# EAGLE board BSides 2015 RevA (EAGLE 7.2.0), part 1 of 5
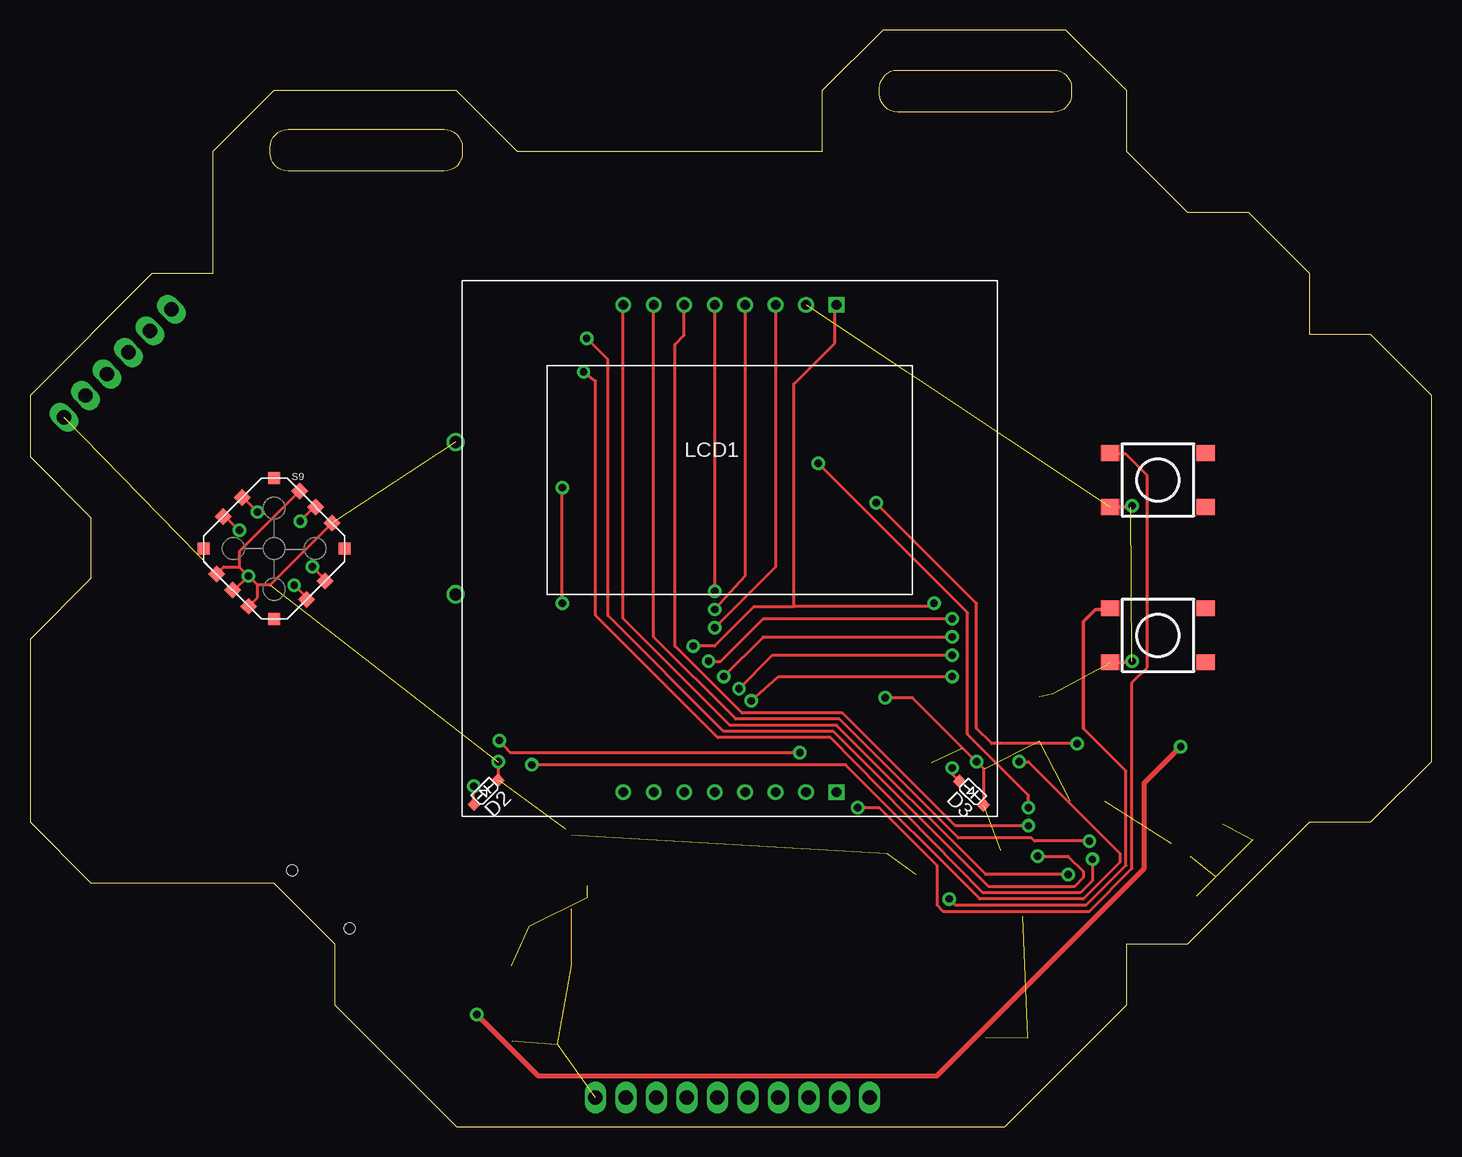
[diagram p1: board, top side]
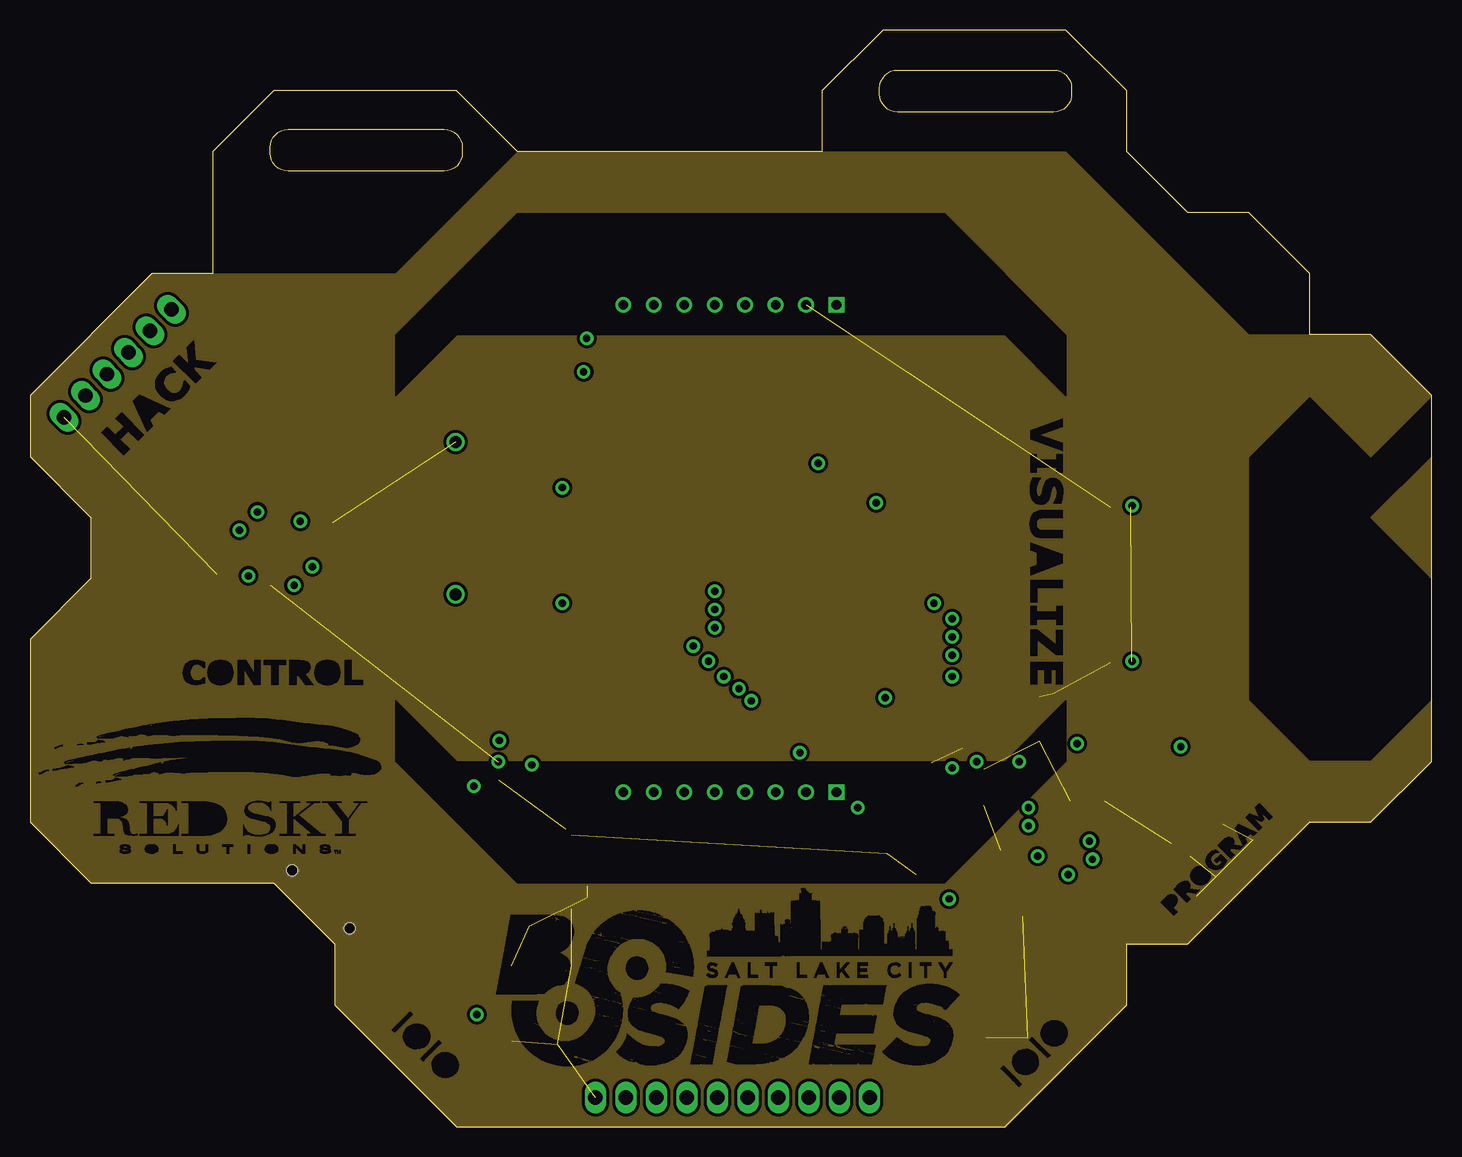
[diagram p2: board, inner layer Route2]
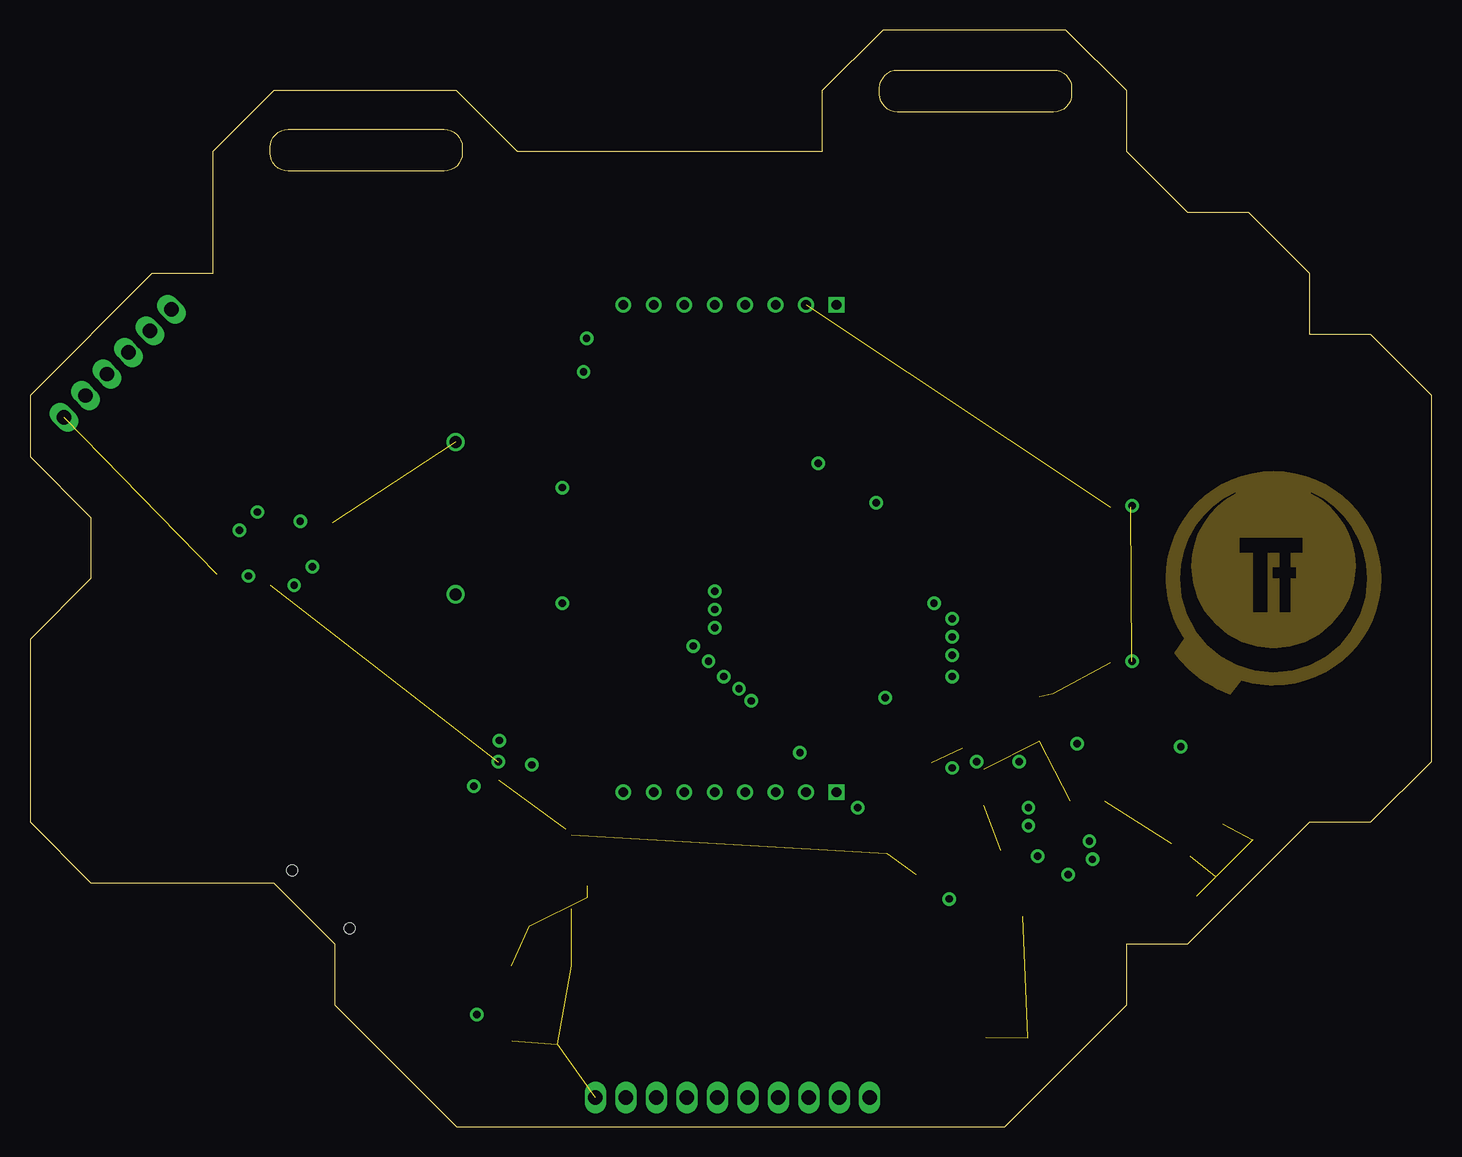
[diagram p3: board, inner layer Route3]
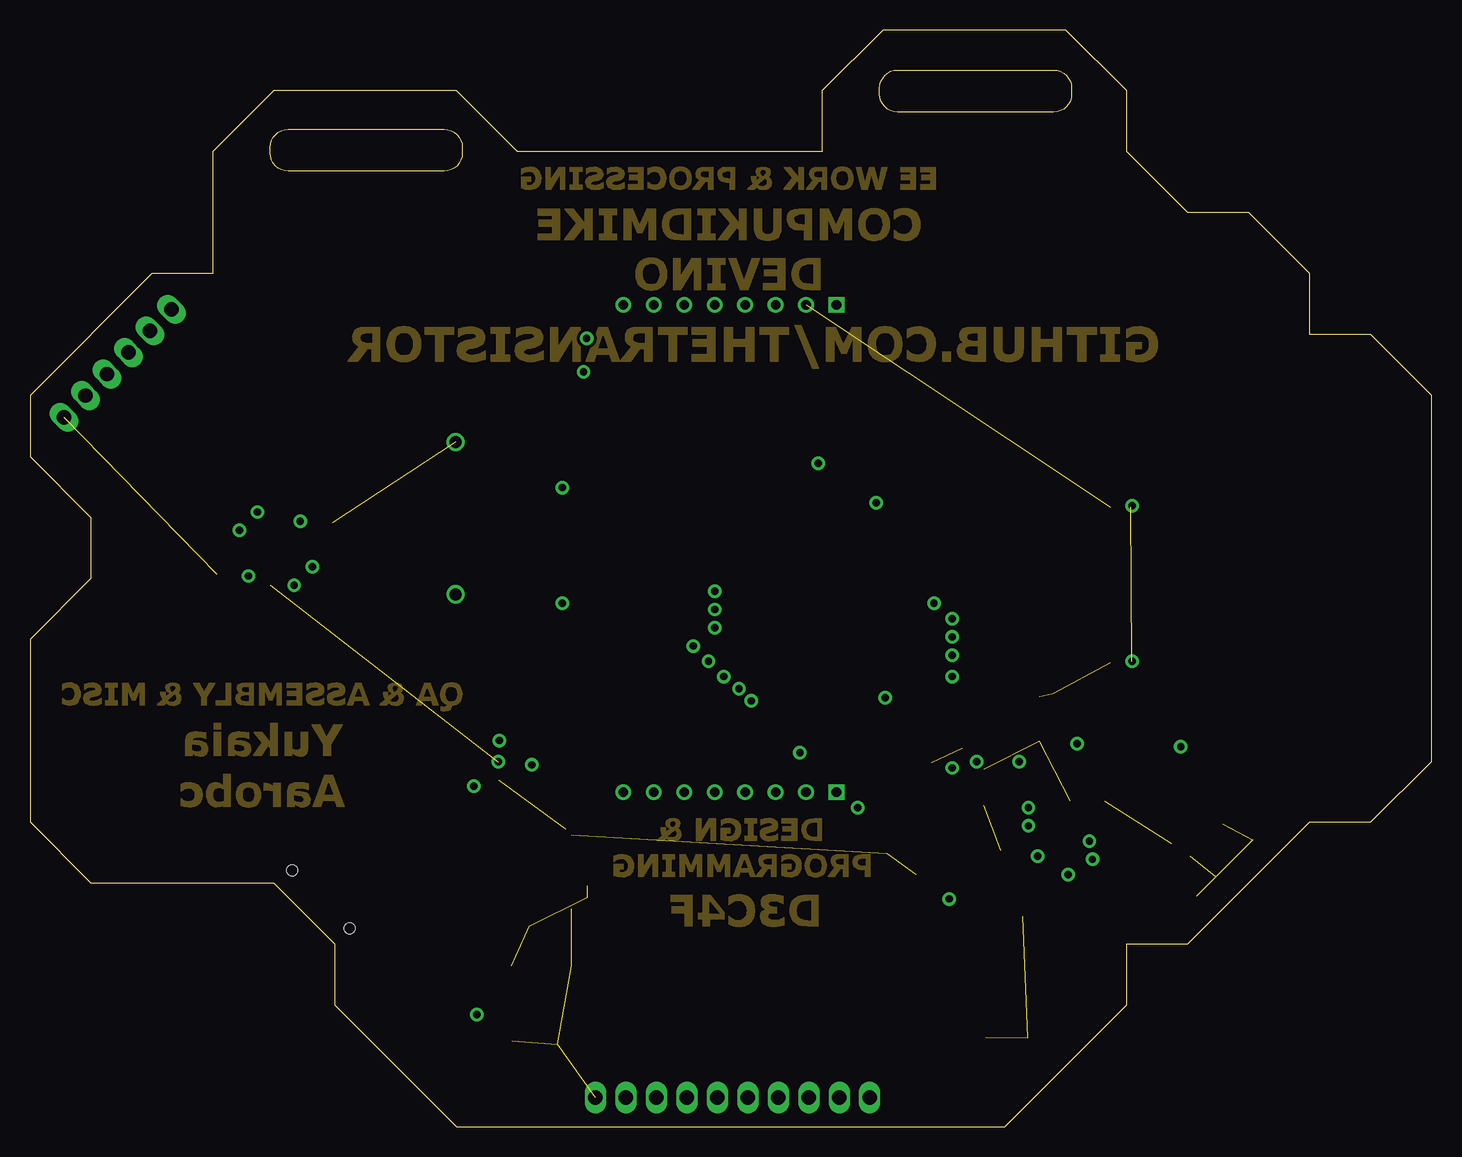
[diagram p4: board, inner layer Route4]
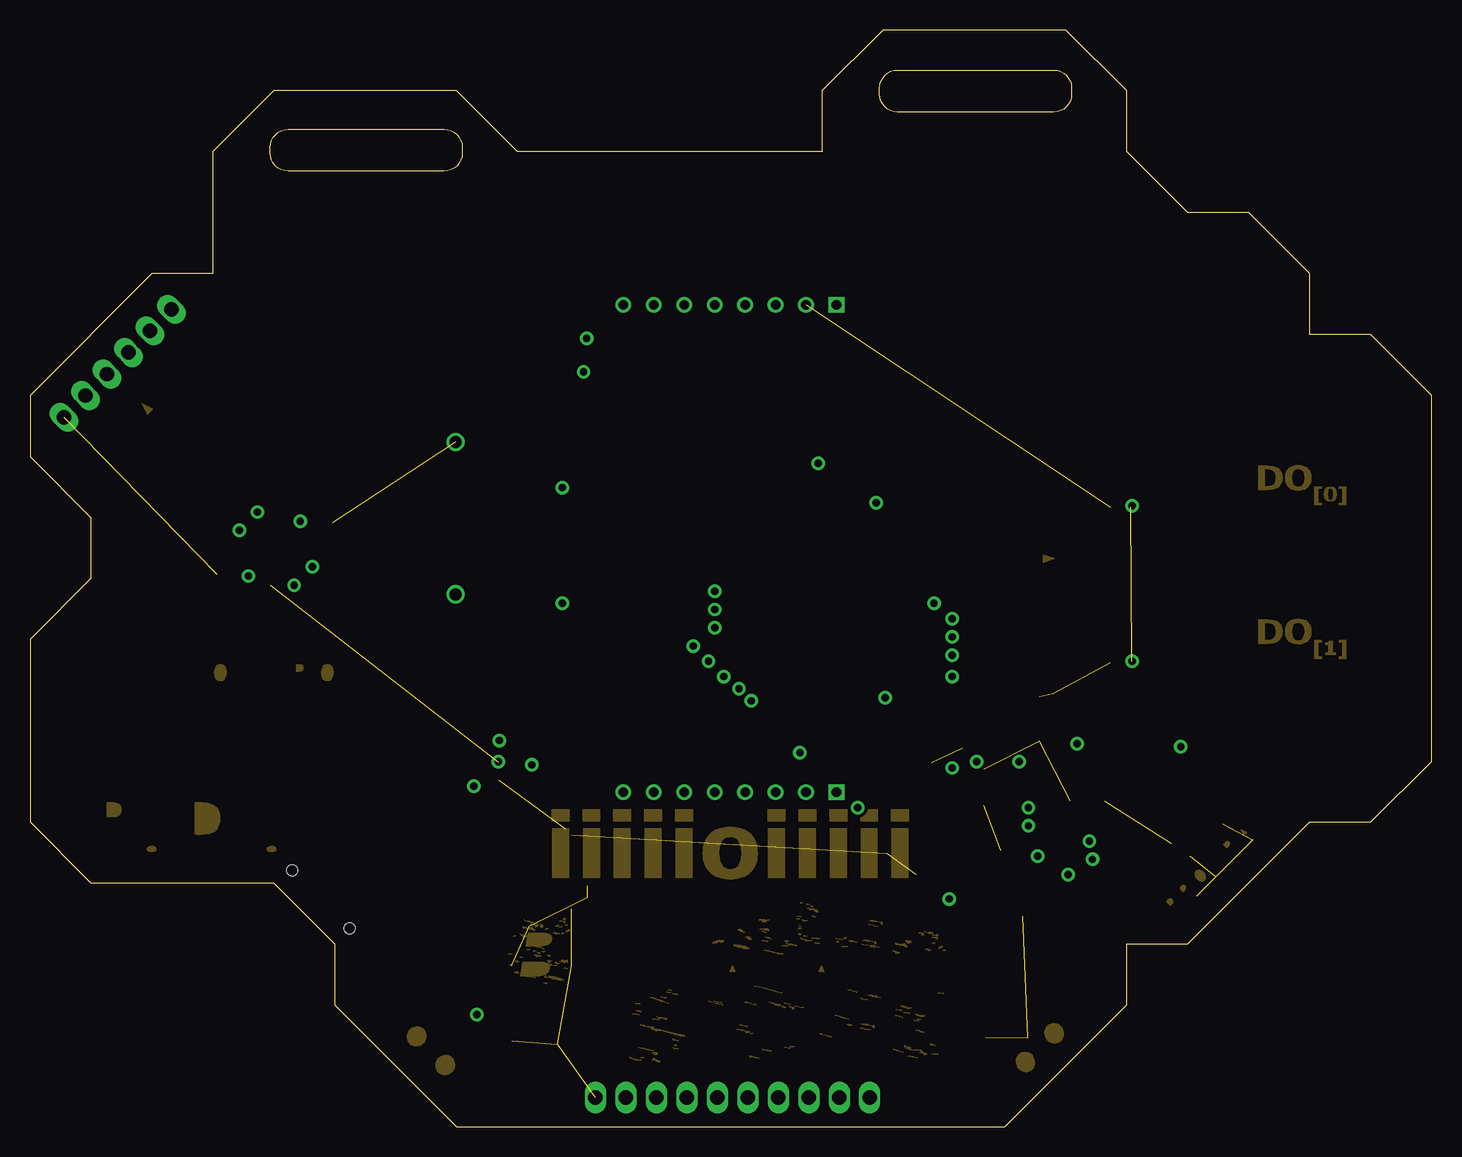
[diagram p5: board, inner layer Route15]
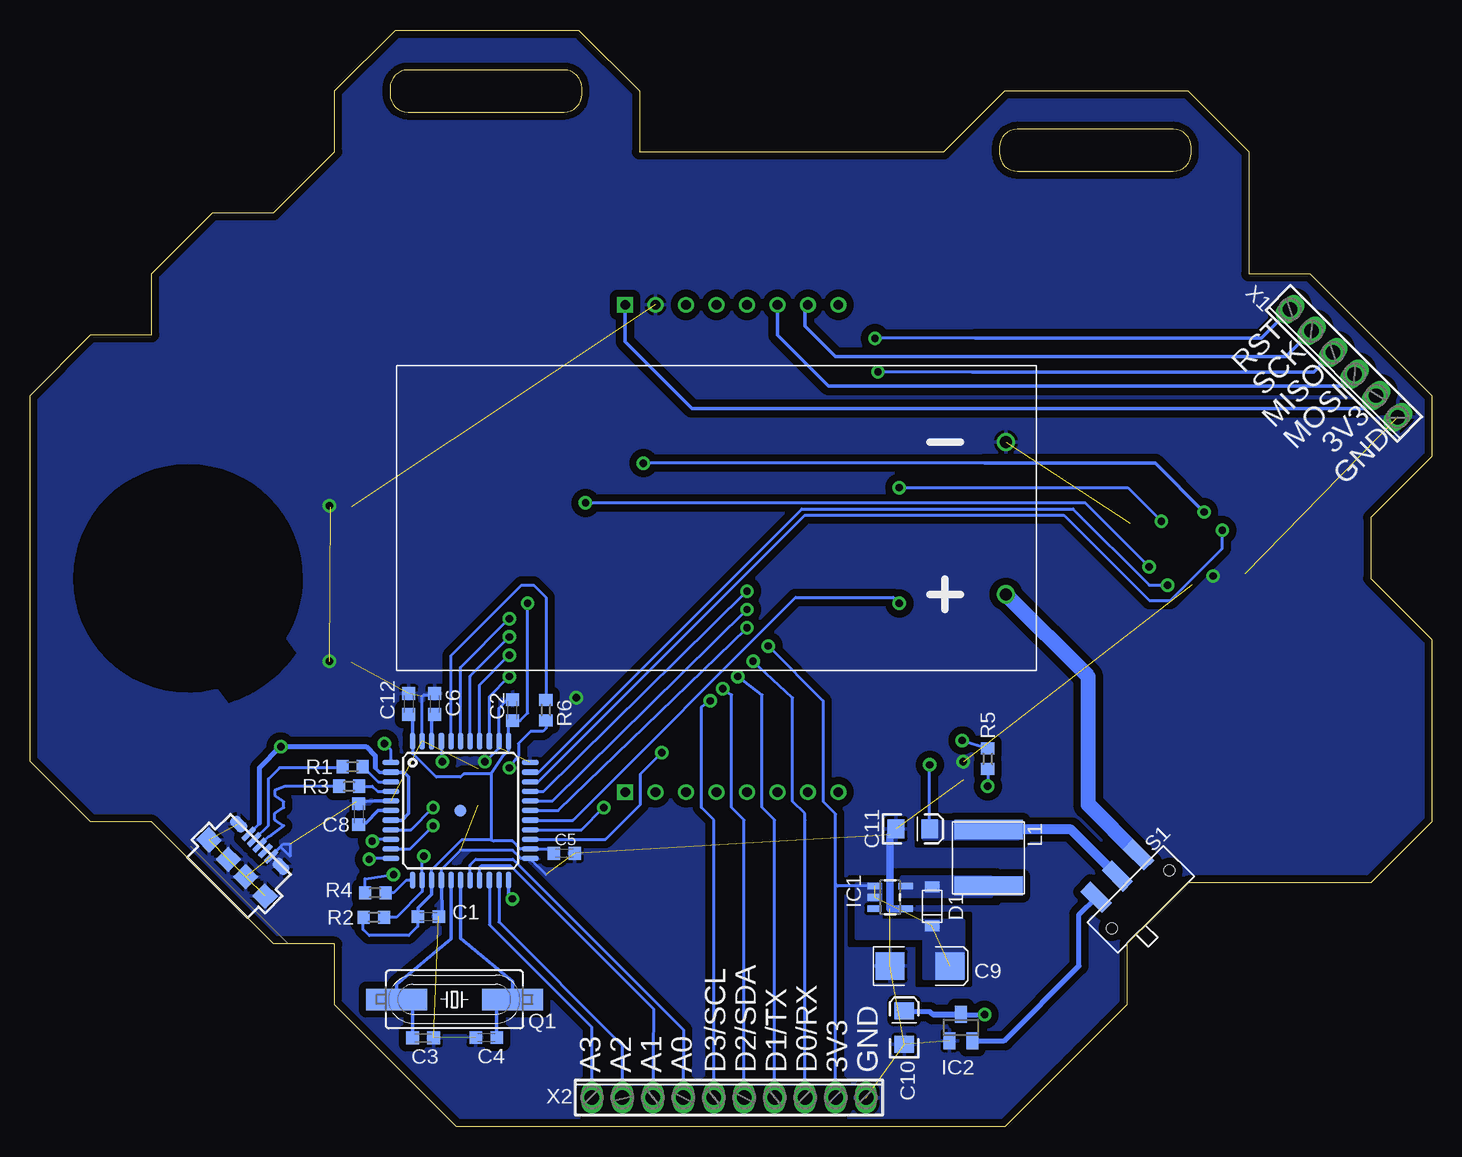
[diagram p6: board, bottom side, seen from below]

Size 116.84 x 91.44 mm. Coordinates in mm from the lower left corner, seen from the top.
Outline: 108 segments
Copper layers (1+2*15+16): Top 0.035mm / dielectric 1.5mm / Route2 0.035mm / dielectric 0.15mm / Route15 0.035mm / dielectric 0.2mm / Bottom 0.035mm
Design rules "default *": minimum track width 10mil, minimum drill 22mil, track to track 10mil, track to pad 10mil, pad to pad 8mil, via to via 12mil, smd to smd 8mil, copper to edge 1mil, drill to drill 12mil, minimum pad ring 10mil, minimum via ring 10mil, stop-mask expansion 2mil, vias tented up to drill 23mil, thermal gap 10mil
Net classes: 0 default: width 0.254 mm, drill 0.61 mm, clearance 0.254 mm; 1 power: width 0.254 mm, drill 0.61 mm, clearance 0.254 mm; 2 gnd: width 0.254 mm, drill 0.61 mm, clearance 0.254 mm; 3 usbvcc: width 0.254 mm, drill 0.61 mm, clearance 0.254 mm; 4 aref: width 0.254 mm, drill 0.61 mm, clearance 0.254 mm
bRestrict: area 78.4,8.3 to 84.5,12.9
vRestrict: area 42.5,38.6 to 43,38.8; area 35.7,35.1 to 36.4,35.6; area 44.4,35.1 to 45.1,35.6; area 41.2,35.1 to 41.7,35.6; area 47.8,10.2 to 48.4,10.7; area 50.3,10.1 to 50.8,11

## Footprints (pad centres in the part's own frame; a part is rotated, then mirrored left to right if it is on the bottom)
2AAA = drill 1: + 24.13,-6.35; - 24.13,6.35
C0603K = smd 1.05 x 1.08: 1 -0.875,0; 2 0.875,0
6032 = smd 2.4 x 2.3: P$1 2.5,0; P$2 -2.5,0
EIA3216 = smd 1.4 x 1.6: A 1.4,0; C -1.4,0
SOD-123 = smd 0.91 x 1.22: P$1 -1.63,0; P$2 1.63,0
LG-Y876 = smd 0.8 x 0.7: A 0,1.45; C 0,-1.45
SOT23-5 = smd 0.55 x 1.2: 1 -0.95,-1.3; 2 0,-1.3; 3 0.95,-1.3; 4 0.95,1.3; 5 -0.95,1.3
SOT23 = smd 1 x 1.4: 1 -0.95,-1.1; 2 0.95,-1.1; 3 0,1.1
CON2_USB_MICRO_B_AT = smd 0.406 x 1.346: P1 -1.321,2.692; P2 -0.66,2.692; P3 0,2.692; P4 0.66,2.692; P5 1.321,2.692 | smd 1.651 x 1.549: S1 -3.302,0; S2 3.302,0 | smd 1.524 x 1.016: S3 -2.489,2.692; S4 2.489,2.692 | smd 1.524 x 1.524: S5 -1.016,0; S6 1.016,0
NR6028 = smd 1.6 x 5.7: P$1 -2.35,0; P$2 2.35,0
5110 = drill 0.8 square: 1 8.89,20.32; 9 8.89,-20.32 | drill 0.8: 2 6.35,20.32; 3 3.81,20.32; 4 1.27,20.32; 5 -1.27,20.32; 6 -3.81,20.32; 7 -6.35,20.32; 8 -8.89,20.32; 10 6.35,-20.32; 11 3.81,-20.32; 12 1.27,-20.32; 13 -1.27,-20.32; 14 -3.81,-20.32; 15 -6.35,-20.32; 16 -8.89,-20.32
SM49 = smd 5.08 x 1.778: 1 -4.826,0; 2 4.826,0
R0603 = smd 1 x 1.1: 1 -0.85,0; 2 0.85,0
SAQN = smd 1.2 x 2.5: 1 -2.5,1.25; 2 0,1.25; 3 2.5,1.25 | hole 0.9: -3.4,-1.5; 3.4,-1.5
TACTILE_SWITCH_TALL = smd 1.55 x 1.3: A1 -3.975,-2.25; A2 3.975,-2.25; B1 -3.975,2.25; B2 3.975,2.25
JS1300 = smd 1 x 1 rotated 315: A -3.867,3.194; B 3.063,-3.736; C 4.618,-2.18; D -2.311,4.75; E 2.497,5.315; F 3.841,3.972; G 5.184,2.628; H -4.433,-1.614; J -3.089,-2.958; K -1.746,-4.301 | smd 1 x 1: NC1 0.376,6.376; NC2 6.245,0.507; NC3 -5.493,0.507; NC4 0.376,-5.362
TQFP44-PAD = smd 1.4 x 0.45: 1 -5.8,4; 2 -5.8,3.2; 3 -5.8,2.4; 4 -5.8,1.6; 5 -5.8,0.8; 6 -5.8,0; 7 -5.8,-0.8; 8 -5.8,-1.6; 9 -5.8,-2.4; 10 -5.8,-3.2; 11 -5.8,-4; 23 5.8,-4; 24 5.8,-3.2; 25 5.8,-2.4; 26 5.8,-1.6; 27 5.8,-0.8; 28 5.8,0; 29 5.8,0.8; 30 5.8,1.6; 31 5.8,2.4; 32 5.8,3.2; 33 5.8,4 | smd 0.45 x 1.4: 12 -4,-5.8; 13 -3.2,-5.8; 14 -2.4,-5.8; 15 -1.6,-5.8; 16 -0.8,-5.8; 17 0,-5.8; 18 0.8,-5.8; 19 1.6,-5.8; 20 2.4,-5.8; 21 3.2,-5.8; 22 4,-5.8; 34 4,5.8; 35 3.2,5.8; 36 2.4,5.8; 37 1.6,5.8; 38 0.8,5.8; 39 0,5.8; 40 -0.8,5.8; 41 -1.6,5.8; 42 -2.4,5.8; 43 -3.2,5.8; 44 -4,5.8 | smd 1 x 1: P$1 0,0
6POL254 = drill 1.2 pad 1.778 long: 1 -6.35,0; 2 -3.81,0; 3 -1.27,0; 4 1.27,0; 5 3.81,0; 6 6.35,0
10POL254 = drill 1.2 long: 1 -11.43,0; 2 -8.89,0; 3 -6.35,0; 4 -3.81,0; 5 -1.27,0; 6 1.27,0; 7 3.81,0; 8 6.35,0; 9 8.89,0; 10 11.43,0

## Placement (x,y rotation side)
B1  2AAA  [2AAA]  59.61,50.75 0 bottom
C1  0.1uF  [C0603K]  83.64,17.52 0 bottom
C2  0.1uF  [C0603K]  76.63,34.75 90 bottom
C3  22p  [C0603K]  84.07,7.42 180 bottom
C4  22p  [C0603K]  78.81,7.44 180 bottom
C5  0.1uF  [C0603K]  72.31,22.81 0 bottom
C6  0.1uF  [C0603K]  83.11,35.25 90 bottom
C8  1uF  [C0603K]  89.43,26.06 90 bottom
C9  47uF  [6032]  42.64,13.41 180 bottom
C10  10uF  [EIA3216]  43.96,8.28 90 bottom
C11  10uF  [EIA3216]  43.24,24.83 0 bottom
C12  0.1uF  [C0603K]  85.26,35.25 90 bottom
D1  MBR0520LT1G  [SOD-123]  41.64,18.37 90 bottom
D2  LG-Y876  [LG-Y876]  38.02,27.89 135 top
D3  LG-Y876  [LG-Y876]  78.48,27.81 45 top
IC1  1402-3.3V  [SOT23-5]  45.14,19.13 270 bottom
IC2  3.3V  [SOT23]  39.24,8.28 0 bottom
J1  USB MICRO  [CON2_USB_MICRO_B_AT]  99.59,21.57 315 bottom
L1  47uH  [NR6028]  36.93,22.43 270 bottom
LCD1  NOKIA5110  [5110]  58.34,48.21 0 top
Q1  8MHz  [SM49]  81.45,10.62 180 bottom
R1  22  [R0603]  89.94,30.02 0 bottom
R2  10K  [R0603]  88.16,17.47 180 bottom
R3  22  [R0603]  90.24,28.4 0 bottom
R4  330  [R0603]  88.06,19.51 180 bottom
R5  130  [R0603]  37,30.68 270 bottom
R6  130  [R0603]  73.83,34.75 270 bottom
S1  JS102011SAQN  [SAQN]  25.31,20.02 45 bottom
S7  SWITCH-MOMENTARY-2SMD-4  [TACTILE_SWITCH_TALL]  94.03,53.92 180 top
S8  SWITCH-MOMENTARY-2SMD-4  [TACTILE_SWITCH_TALL]  94.03,40.97 180 top
S9  JS1300  [JS1300]  19.99,47.7 0 top
U2  ATMEGA32U4-XUAU  [TQFP44-PAD]  80.95,26.36 0 bottom
X1  [6POL254]  7.31,63.65 135 bottom
X2  [10POL254]  58.57,2.44 0 bottom

## Tracks (layer width: path | path; a pad name or v marks a point on that pad's centre or on a via)
+3V3  (via drill 0.61)  (3 unrouted)
  Top 0.254: v75.36,43.64 75.1,43.38 63.67,43.38 | v55.29,40.08 57.07,40.08 60.37,43.38 63.67,43.38 | 63.67,43.38 63.67,61.92 67.1,65.35 67.1,68.4 LCD1.1
  Bottom 0.254: C5.1 73.54,23.16 U2.24 75.97,23.16 76.63,23.82 78.15,23.82 78.41,23.93 | 78.41,23.93 80.84,23.93 83.35,21.42 U2.14 | X2.9 49.68,20.27 | 49.68,20.27 49.68,26.08 50.72,27.13 50.72,35.51 v55.29,40.08 | IC1.1 49.49,20.08 49.68,20.27 | 78.41,29.41 80.69,29.41 80.95,29.16 82.98,29.16 84.95,31.13 U2.44 | 78.41,29.41 77.39,30.94 76.95,31.38 U2.34 76.95,33.55 C2.1 75.98,33.87 75.36,34.49 v75.36,43.64 | 78.41,29.41 78.41,23.93 | C1.1 84.51,16.7 85.26,15.95 88.57,15.95 89.07,16.46 89.07,17.41 R2.2
  Bottom 0.305: U2.14 83.35,19.39 84.5,18.24 84.5,17.28 C1.1 | U2.44 84.95,34.06 C12.1 | X1.2 5.69,59.89 61.64,59.89 67.23,65.48 LCD1.1
  pour Bottom (no thermals): 45.89,20.27 47.93,20.27 47.93,15.7 42.34,15.7 42.34,12.39 39.04,12.39 39.04,17.22 45.89,17.22
A  (via drill 0.61)
  Top 0.254: v69.01,26.62 70.79,26.62 75.61,21.79 75.61,18.49 76.12,17.98 88.31,17.98 91.87,21.54 91.87,37.03 93.14,38.3 93.14,54.3 91.36,56.08 90.14,56.08 S7.A2
  Bottom 0.254: U2.26 70.86,24.76 v69.01,26.62
A0  (via drill 0.61)
  Top 0.254: v60.12,35.51 62.4,37.54 v76.88,37.54
  Bottom 0.254: X2.5 59.84,25.58 60.88,26.62 60.88,35 v60.12,35.51 | U2.36 78.55,35.88 v76.88,37.54
A1  (via drill 0.61)
  Top 0.254: v59.1,36.52 61.9,39.32 v76.88,39.32
  Bottom 0.254: X2.6 57.3,25.58 58.34,26.62 58.34,36.02 v59.1,36.52 | U2.37 79.35,36.85 v76.88,39.32
A2  (via drill 0.61)
  Top 0.254: v57.83,37.54 61.13,40.84 v76.88,40.84
  Bottom 0.254: X2.7 54.76,25.58 55.8,26.62 55.8,36.02 v57.83,37.54 | U2.38 80.15,37.58 v76.88,40.84
A3  (via drill 0.61)
  Top 0.254: v56.56,38.81 57.58,38.81 61.13,42.37 v76.88,42.37
  Bottom 0.254: X2.8 52.22,25.58 52.24,25.6 52.24,26.11 53.26,27.13 53.26,35.76 v56.56,38.81 | U2.39 80.95,38.3 v76.88,42.37
A4
  Bottom 0.254: U2.40 81.75,39.28 75.87,45.16 74.85,45.16 73.83,44.14 R6.1
AREF
  Bottom 0.305: U2.42 83.35,34.26 C6.1
B  (via drill 0.61)
  Top 0.254: v76.63,19 77.14,18.49 88.06,18.49 91.36,21.79 91.36,29.67 87.8,33.22
  Top 0.305: 87.8,33.22 87.8,42.11 88.82,43.13 89.96,43.13 S8.A2
  Bottom 0.305: U2.22 76.95,19.32 v76.63,19
CE  (via drill 0.61)
  Top 0.254: LCD1.3 62.15,46.68 v57.07,41.6
  Bottom 0.254: U2.28 72.82,26.36 v57.07,41.6
CENTER  (via drill 0.61)
  Top 0.254: S9.F 23.7,51.67 v22.53,50.49 | v44.37,43.64 v44.37,53.29
  Bottom 0.254: U2.27 71.59,25.56 53.01,44.14 44.88,44.14 v44.37,43.64 | v44.37,53.29 25.32,53.29 v22.53,50.49
D0/RX
  Bottom 0.254: U2.20 78.55,16.85 70.02,8.33 70.02,1.95 X2.1
D1/TX
  Bottom 0.254: U2.21 77.75,17.07 67.48,6.81 67.48,1.95 X2.2
D2/SDA
  Bottom 0.254: U2.19 79.35,21.61 79.17,21.79 76.81,21.79 64.87,9.85 64.94,1.95 X2.3
D3/SCL
  Bottom 0.254: U2.18 80.15,21.83 79.68,22.3 76.58,22.3 62.35,8.08 62.4,1.95 X2.4
D4  (via drill 0.61)
  Top 0.254: v64.18,31.19 40.05,31.19 v39.12,32.21
  Bottom 0.254: U2.25 68.87,23.96 65.96,26.87 65.96,29.41 v64.18,31.19 | v39.12,32.21 R5.1
D/C  (via drill 0.61)
  Top 0.254: LCD1.5 v57.07,44.65
  Bottom 0.254: U2.30 74.01,27.96 v57.07,44.65
D_N
  Bottom 0.254: R1.1 90.9,29.92 96.04,29.92 96.95,29.01 96.95,25.14 J1.P2
D_P
  Bottom 0.254: R3.1 92.36,28.4 95.57,28.4 96.44,28.04 96.44,27.63 95.68,27.13 95.68,26.62 96.44,26.11 96.44,25.6 95.68,25.09 96.69,24.33 96.95,24.21 J1.P3
DOWN  (via drill 0.61)
  Top 0.254: S9.B 23.05,44.13 v22.02,45.16
  Bottom 0.254: U2.32 74.44,29.56 52.5,51.51 29.89,51.51 23.54,45.16 v22.02,45.16
GND  (via drill 0.61)  (26 unrouted)
  Top 0.254: D3.C 79.51,29.84 v78.91,30.43 73.58,35.76 v71.29,35.76 | D2.C 39.05,30.16 v39.04,30.43 | S9.J 17.03,44.74 v18.21,45.92 | S9.H 16.15,46.68 17.45,46.68 | 17.45,46.68 v18.21,45.92 | S9.K 18.97,44.13 18.97,45.16 | 18.97,45.16 v18.21,45.92 | S9.G 20,45.16 18.97,45.16 | S9.E 17.45,47.98 17.45,46.68
  Top 0.305: S7.B2 91.78,51.67 v91.87,51.76 | S8.B2 91.78,38.72 v91.87,38.81
  Bottom 0.254: C2.2 76.74,35.51 77.14,35.51 77.75,34.9 U2.35 77.75,31.6 v78.91,30.43 | U2.43 84.15,35.86 83.99,36.02 83.35,36.02 C6.2 | U2.15 82.55,21.46 80.95,23.06 76.6,23.06 75.91,22.36 U2.23 75.15,22.34 73.83,21.03 | J1.P5 95.72,23.57 95.17,23.57 95.17,22.55 95.93,23.32 96.69,22.55 95.92,21.78 J1.S4
  Bottom 0.305: U2.5 88.1,27.16 88.82,27.13 89.62,27.13 C8.2 | U2.15 82.55,19.07 82.47,18.74 82.47,17.56 C1.2
  Bottom 0.61: IC1.4 45.13,18.18 45.13,24.33 44.64,24.33 C11.C
  pour Bottom (isolate 0.61, rank 6): -0.08,-0.05 116.76,-0.05 116.76,91.39 -0.08,91.39
LED
  Bottom 0.254: U2.12 85.48,20.56 86.53,19.51 R4.1
LEFT  (via drill 0.61)
  Top 0.254: S9.A 16.28,50.89 v17.45,49.73
  Bottom 0.254: U2.31 74.48,28.76 52.24,51 30.65,51 23.54,43.89 21.76,43.89 17.45,48.21 v17.45,49.73
MISO  (via drill 0.61)
  Top 0.254: v88.57,22.3 88.57,20.52 87.55,19.51 79.42,19.51 66.72,32.46 57.32,32.46 47.16,42.62 47.16,62.18 v46.15,62.94
  Bottom 0.254: U2.11 88.5,22.36 v88.57,22.3 | 38.27,62.94 v46.15,62.94
  Bottom 0.305: X1.4 9.82,62.94 38.27,62.94
MOSI  (via drill 0.61)
  Top 0.254: v83.23,25.09 77.14,25.09 67.74,34.49 59.36,34.49 53.77,40.08 53.77,65.23 54.53,65.99 LCD1.6
  Bottom 0.254: U2.10 85.16,23.16 v83.23,25.09
  Bottom 0.305: X1.3 6.52,62.69 7.47,61.74 50.28,61.74 54.53,65.99 LCD1.6
N$1
  pour Bottom (no thermals): 36.75,20.78 36.75,19.25 44.12,19.25 44.12,20.78
N$2
  Bottom 0.406: IC2.2 35.62,7.18 29.38,13.41 29.38,17.72 S1.1
N$3
  Bottom 1.27: S1.3 28.62,26.87 28.62,37.54 B1.+
N$4
  pour Route2: 111.77,66.01 106.69,66.01 106.69,66.01 101.61,66.01 86.37,81.25 40.65,81.25 30.49,71.09 10.17,71.09 0.01,60.93 0.01,55.85 5.09,50.77 5.09,45.69 0.01,40.61 0.01,25.37 5.09,20.29 20.33,20.29 25.41,15.21 25.41,10.13 35.57,-0.03 81.29,-0.03 91.45,10.13 91.45,15.21 96.53,15.21 106.69,25.37 111.77,25.37 116.85,30.45 116.85,35.53 111.77,30.45 106.69,30.45 101.61,35.53 101.61,55.85 106.69,60.93 111.77,55.85 116.85,60.93
N$5
  cutout Route2: 83.43,36.86 83.43,38.77 86.07,38.77 86.07,36.86 85.56,36.86 85.56,38.09 85.11,38.09 85.11,36.95 84.59,36.95 84.59,38.09 83.94,38.09 83.94,36.86
N$6
  cutout Route2: 83.43,39.25 83.43,41.47 83.92,41.47 85.56,40.15 85.56,41.41 86.07,41.41 86.07,39.32 85.57,39.32 83.94,40.64 83.94,39.25
N$7
  cutout Route2: 83.43,41.85 83.43,43.4 83.9,43.4 83.9,42.97 85.61,42.97 85.61,43.4 86.07,43.4 86.07,41.85 85.61,41.85 85.61,42.28 83.9,42.28 83.9,41.85
N$8
  cutout Route2: 83.43,43.69 83.43,45.6 86.07,45.6 86.07,44.92 83.94,44.92 83.94,43.69
N$9
  cutout Route2: 83.43,45.98 83.43,46.69 83.96,46.87 83.96,47.85 83.43,48.04 83.43,48.73 86.07,47.75 86.07,46.96
N$10
  pour Route15: 84.45,47.04 85.4,47.36 84.45,47.69
N$11
  cutout Route2: 84.39,49.07 84.27,49.07 84.16,49.09 84.05,49.11 83.95,49.14 83.86,49.18 83.78,49.24 83.7,49.3 83.63,49.37 83.57,49.45 83.52,49.53 83.48,49.63 83.44,49.74 83.39,49.97 83.37,50.25 83.39,50.52 83.44,50.76 83.48,50.86 83.52,50.96 83.57,51.05 83.63,51.13 83.7,51.2 83.78,51.26 83.86,51.31 83.95,51.35 84.05,51.38 84.15,51.41 84.27,51.42 84.38,51.42 86.07,51.42 86.07,50.74 84.42,50.74 84.29,50.73 84.18,50.71 84.09,50.67 84.01,50.62 83.95,50.56 83.91,50.47 83.89,50.37 83.88,50.25 83.89,50.13 83.91,50.03 83.95,49.94 84.01,49.87 84.08,49.82 84.18,49.78 84.29,49.76 84.42,49.75 86.07,49.75 86.07,49.07
N$12
  cutout Route2: 84.26,51.85 84.17,51.86 84.08,51.88 83.99,51.9 83.91,51.94 83.83,51.98 83.76,52.04 83.69,52.11 83.63,52.19 83.57,52.27 83.52,52.37 83.48,52.47 83.44,52.58 83.4,52.82 83.38,53.09 83.4,53.4 83.44,53.66 83.59,54.12 84.22,54.12 84.22,54.04 84.14,53.94 84.07,53.82 84.01,53.7 83.96,53.57 83.92,53.44 83.89,53.31 83.88,53.19 83.87,53.07 83.88,52.9 83.92,52.74 84,52.61 84.06,52.57 84.14,52.56 84.22,52.58 84.29,52.63 84.39,52.85 84.45,53.16 84.53,53.48 84.59,53.63 84.66,53.76 84.74,53.87 84.83,53.96 84.92,54.02 85.03,54.07 85.16,54.09 85.29,54.1 85.38,54.1 85.46,54.08 85.55,54.06 85.62,54.02 85.7,53.97 85.77,53.92 85.83,53.85 85.89,53.77 85.99,53.59 86.07,53.39 86.11,53.17 86.12,52.92 86.07,52.4 85.95,51.96 85.34,51.96 85.34,52.03 85.45,52.21 85.55,52.42 85.59,52.54 85.61,52.66 85.63,52.78 85.64,52.9 85.62,53.07 85.58,53.23 85.5,53.35 85.38,53.4 85.33,53.4 85.29,53.38 85.25,53.36 85.22,53.32 85.11,53.02 85.06,52.74 84.98,52.45 84.92,52.31 84.86,52.18 84.79,52.08 84.71,52 84.61,51.94 84.51,51.89 84.39,51.86
N$13
  cutout Route2: 83.43,54.53 83.43,56.08 83.9,56.08 83.9,55.65 85.61,55.65 85.61,56.08 86.07,56.08 86.07,54.53 85.61,54.53 85.61,54.96 83.9,54.96 83.9,54.53
N$14
  cutout Route2: 86.07,56.34 83.43,57.31 83.43,58.07 86.07,59.04 86.07,58.32 84.21,57.68 86.07,57.04
N$15
  cutout Route2: 103.57,25.85 103.29,25.57 102.57,26.3 102.84,25.63 102.64,25.43 101.97,25.71 102.7,24.98 102.43,24.71 101.35,25.8 101.67,26.13 102.46,25.83 102.16,26.61 102.49,26.94
N$16
  cutout Route2: 102.28,24.56 101.99,24.27 101.69,24.41 101.29,24.01 101.43,23.71 101.15,23.43 100.46,24.92 100.79,25.24
N$17
  pour Route15: 101.42,24.54 100.9,24.8 101.16,24.27
N$18
  cutout Route2: 101.15,23.43 100.81,23.09 100.11,23.19 99.98,23.06 100.38,22.66 100.1,22.38 99.01,23.47 99.48,23.94 99.66,24.09 99.84,24.18 100.03,24.18 100.21,24.07 100.27,24.01 100.31,23.95 100.34,23.88 100.35,23.82 100.35,23.68 100.32,23.53
N$19
  pour Route15: 99.96,23.74 99.87,23.8 99.77,23.79 99.68,23.73 99.59,23.65 99.49,23.55 99.78,23.25 99.87,23.34 99.98,23.46 100.02,23.57 100.02,23.66
N$20
  cutout Route2: 99.79,22.19 99.65,21.94 99.44,21.67 99.3,21.55 99.15,21.46 99,21.41 98.85,21.39 98.7,21.4 98.55,21.45 98.41,21.53 98.28,21.65 98.17,21.78 98.09,21.92 98.04,22.06 98.03,22.21 98.05,22.37 98.1,22.52 98.19,22.67 98.31,22.81 98.54,23 98.83,23.14 99.09,22.88 99.06,22.85 98.95,22.83 98.83,22.81 98.69,22.75 98.55,22.64 98.44,22.49 98.4,22.31 98.43,22.13 98.56,21.94 98.65,21.86 98.75,21.81 98.84,21.77 98.94,21.76 99.03,21.77 99.13,21.81 99.22,21.87 99.31,21.95 99.35,21.99 99.38,22.02 99.17,22.24 98.95,22.02 98.75,22.22 99.25,22.73
N$21
  cutout Route2: 98.13,21.5 98.24,21.36 98.32,21.22 98.38,21.08 98.39,20.93 98.38,20.78 98.33,20.64 98.25,20.5 98.13,20.37 98,20.25 97.86,20.17 97.72,20.12 97.57,20.11 97.42,20.13 97.28,20.18 97.14,20.26 97.01,20.37 96.89,20.51 96.81,20.65 96.76,20.79 96.74,20.94 96.76,21.09 96.8,21.23 96.89,21.37 97,21.5 97.13,21.62 97.27,21.7 97.42,21.74 97.56,21.76 97.71,21.74 97.86,21.69 98,21.61
N$22  (via drill 0.61)
  Top 0.254: v86.53,21.03 79.68,21.03 67.23,33.48 58.34,33.48 49.45,42.37 LCD1.8
  Bottom 0.254: R4.2 88.91,20.69 v86.53,21.03
N$23
  pour Route15: 98.03,20.85 97.98,21.03 97.84,21.2 97.65,21.35 97.48,21.4 97.33,21.38 97.21,21.3 97.12,21.18 97.1,21.03 97.15,20.85 97.3,20.66 97.49,20.52 97.66,20.47 97.8,20.49 97.93,20.57 98.01,20.7
N$24
  cutout Route2: 97.49,19.77 97.15,19.43 96.45,19.53 96.32,19.4 96.72,19 96.44,18.72 95.36,19.81 95.83,20.28 96,20.44 96.18,20.52 96.37,20.52 96.47,20.48 96.55,20.41 96.61,20.35 96.65,20.29 96.68,20.23 96.69,20.16 96.7,20.02 96.66,19.87
N$25
  pour Route15: 96.3,20.09 96.21,20.14 96.11,20.13 96.03,20.08 95.94,19.99 95.84,19.89 96.13,19.6 96.21,19.68 96.32,19.8 96.37,19.91 96.36,20
N$26
  cutout Route2: 95.5,19.27 95.62,19.1 95.66,18.91 95.61,18.67 95.45,18.44 95.27,18.26 95.63,17.91 95.35,17.63 94.26,18.71 94.72,19.18 94.91,19.33 95.09,19.41 95.3,19.4
N$27
  pour Route15: 95.22,18.97 95.11,19.03 95.01,19.01 94.9,18.95 94.79,18.84 94.74,18.79 95.07,18.47 95.15,18.55 95.26,18.67 95.3,18.79 95.28,18.88
N$28
  cutout Route2: 70.22,9.2 70.2,9.21 70.21,9.22 70.19,9.24 70.16,9.25 67.46,9.25 67.56,9.78 67.27,9.86 67.24,9.86 67.26,9.89 67.28,9.9 66.83,9.98 66.29,10.09 66.24,10.1 66.29,10.12 66.31,10.13 66.13,10.17 65.86,10.23 65.56,8.6 65.98,8.51 66,8.5 66,8.49 66.07,8.48 66.2,8.46 66.32,8.44 66.4,8.41 66.44,8.38 66.44,8.37 66.44,8.37 66.44,8.35 66.43,8.33 66.4,8.31 66.37,8.31 66.3,8.32 66.28,8.32 65.99,8.38 65.71,8.47 65.54,8.52 65.49,8.22 65.89,8.11 66.31,7.99 66.74,7.89 67.19,7.78 67.2,7.83 70.32,7.83 70.56,9.14 70.4,9.17
N$29
  cutout Route2: 66.39,8.45 66.35,8.45 66.22,8.47 66.12,8.5 66.08,8.5 66.11,8.53 66.16,8.54 66.29,8.53 66.4,8.48 66.42,8.46
N$30
  cutout Route2: 65.87,8.28 65.87,8.27 65.85,8.27 65.78,8.31 65.78,8.36 65.78,8.36 65.78,8.36 65.83,8.37 65.87,8.34
N$31
  cutout Route2: 69.36,8.81 69.38,8.86 69.39,8.87 69.4,8.88 69.41,8.88 69.46,8.85 69.46,8.8 69.46,8.79 69.49,8.76 69.5,8.75 69.49,8.74 69.42,8.7 69.39,8.71 69.37,8.72 69.38,8.73 69.44,8.79 69.42,8.79 69.38,8.79 69.36,8.79
N$32
  pour Route15: 67.13,9.31 67.19,9.34 67.31,9.29 67.38,9.26 67.38,9.26 67.38,9.26 67.38,9.25 67.42,9.24 68.24,8.98 68.23,8.95 68.01,8.98 67.77,9.04 67.65,9.08 67.54,9.12 67.46,9.16 67.4,9.21 67.38,9.22 67.35,9.22 67.24,9.25 67.14,9.28 67.09,9.28
N$33
  cutout Route2: 67.28,8.06 67.37,8.06 67.39,8.05 67.35,8.04
N$34
  cutout Route2: 67.18,8.06 67.11,8.08 67.1,8.06 67.09,8.08 67.08,8.12 67.12,8.13 67.22,8.11 67.27,8.1 67.29,8.1 67.28,8.07 67.24,8.04
N$35
  cutout Route2: 67.44,7.87 67.37,7.87 67.32,7.87 67.3,7.87 67.25,7.88 67.2,7.9 67.25,7.92 67.32,7.93 67.4,7.92 67.48,7.89
N$36
  pour Route2: 67.74,8.2 67.7,8.19 67.61,8.2 67.5,8.21 67.45,8.2 67.49,8.24 67.58,8.28 67.67,8.25 67.74,8.23 67.84,8.22
N$37
  cutout Route2: 68.03,8.22 68.03,8.2 68.01,8.21 67.97,8.22 67.9,8.25 67.91,8.29 67.91,8.3 67.93,8.3 67.98,8.28 68.03,8.26
N$38
  pour Route15: 68.5,8.46 68.45,8.44 68.4,8.45 68.35,8.47 68.33,8.45 68.33,8.42 68.3,8.43 68.25,8.47 68.19,8.52 68.16,8.53 68.18,8.55 68.25,8.57 68.38,8.54 68.49,8.48 68.51,8.47
N$39
  pour Route2: 68.73,8.38 68.63,8.39 68.52,8.43 68.51,8.44 68.53,8.45 68.57,8.47 68.64,8.45 68.7,8.44 68.77,8.4
N$40
  cutout Route2: 69.05,8.19 69.02,8.17 68.93,8.19 68.87,8.21 68.81,8.21 68.86,8.24 68.91,8.25 68.98,8.23 69.05,8.22 69.1,8.22
N$41
  pour Route2: 69.11,8.61 69.02,8.63 68.85,8.7 68.79,8.73 68.86,8.73 68.95,8.73 69.02,8.71 69.08,8.68 69.13,8.64 69.16,8.59
N$42
  pour Route15: 69.57,8.14 69.38,8.2 69.2,8.23 69.38,8.23 69.68,8.17 69.95,8.11 70.07,8.1 69.95,8.08 69.89,8.07 69.73,8.09
N$43
  cutout Route2: 69.79,8.16 69.84,8.2 69.89,8.21 69.97,8.19 70.01,8.18 70.04,8.17 70.02,8.15 69.97,8.12 69.91,8.14 69.85,8.16
N$44
  cutout Route2: 70.27,7.96 70.22,7.95 70.11,7.98 69.98,8.03 69.94,8.03 69.97,8.06 70.02,8.07 70.27,7.99 70.29,7.98
N$45
  pour Route15: 70.38,8.25 70.38,8.24 70.37,8.24 70.31,8.26 70.3,8.27 70.29,8.28 70.29,8.29 70.32,8.32 70.33,8.33 70.34,8.34 70.33,8.34 70.07,8.4 69.84,8.47 69.78,8.48 69.72,8.47 69.65,8.46 69.45,8.51 69.32,8.54 69.33,8.58 69.45,8.57 69.49,8.6 69.52,8.61 69.69,8.57 69.82,8.54 69.85,8.54 69.83,8.51 69.82,8.5 69.84,8.5 69.89,8.51 70.1,8.46 70.29,8.42 70.3,8.43 70.33,8.45 70.35,8.44 70.34,8.35 70.34,8.35 70.36,8.34 70.39,8.31
N$46
  cutout Route2: 70.39,9.24 70.47,9.21 70.52,9.2 70.57,9.19 70.58,9.25 70.36,9.25
N$47
  cutout Route15: 76,11.13 75.99,11.14 75.89,11.17 75.92,11.16
N$48
  cutout Route2: 351 corners
N$49
  cutout Route2: 75.46,8.98 75.51,8.99 75.6,8.98 75.68,8.97 75.71,8.97 75.7,8.95 75.68,8.91 75.63,8.89 75.56,8.91 75.48,8.93 75.46,8.91 75.45,8.94
N$50
  cutout Route2: 75.17,9.11 75.21,9.14 75.25,9.12 75.3,9.1 75.39,9.11 75.31,9.07 75.26,9.06 75.2,9.07 75.18,9.08 75.16,9.09
N$51
  cutout Route2: 75.97,11.51 75.98,11.54 76.02,11.56 76.05,11.55 76.08,11.55 76.1,11.52 76.08,11.51 76.02,11.48 75.98,11.5 75.97,11.5
N$52
  pour Route15: 75.73,11.16 75.8,11.19 75.85,11.18 75.87,11.2 75.92,11.22 76.06,11.18 76.09,11.16 76.13,11.14 76.09,11.12 76.07,11.12 76.12,11.11 76.02,11.09 75.92,11.08 75.82,11.09 75.73,11.13 75.71,11.14
N$53
  cutout Route2: 75.56,11.64 75.57,11.66 75.58,11.66 75.64,11.63 75.64,11.58 75.64,11.56 75.63,11.56 75.56,11.59
N$54
  pour Route15: 73.79,8.88 73.82,8.88 74.03,8.82 74.07,8.8 74.03,8.79 74.01,8.79 73.87,8.82 73.79,8.84 73.68,8.85
N$55
  pour Route15: 73.94,8.95 73.99,8.99 74.06,9.01 74.21,8.98 74.22,8.97 74.21,8.96 74.17,8.93 74.13,8.93 74.1,8.94 74.09,8.93 74.08,8.91 74.07,8.91 74.03,8.93 74.02,8.95 74.02,8.96 74,8.96
N$56
  cutout Route15: 73.25,9.33 73.39,9.3 73.39,9.29 73.42,9.28 73.39,9.28 73.39,9.26 73.3,9.27 73.22,9.31 73.22,9.32 73.22,9.33 73.25,9.33 73.25,9.32
N$57
  pour Route2: 73.37,9.38 73.31,9.38 73.36,9.41 73.41,9.43 73.46,9.42 73.51,9.4 73.53,9.4 73.52,9.37 73.47,9.34 73.43,9.36
N$58
  pour Route2: 73.48,9.51 73.45,9.5 73.42,9.49 73.41,9.46 73.39,9.49 73.38,9.51 73.33,9.54 73.24,9.54 73.32,9.58 73.38,9.59 73.38,9.59 73.38,9.59 73.4,9.59 73.53,9.57 73.65,9.52 73.68,9.51 73.65,9.49 73.57,9.48
N$59
  cutout Route2: 73.5,9.77 73.53,9.79 73.58,9.78 73.62,9.77 73.65,9.77 73.64,9.74 73.59,9.71 73.55,9.73 73.51,9.74 73.49,9.75
N$60
  cutout Route2: 73.13,11.31 73.19,11.3 73.33,11.24 73.37,11.21 73.33,11.2 73.31,11.2 73.27,11.21 73.21,11.22 73.15,11.25 73.11,11.29 73.1,11.33
N$61
  cutout Route2: 73.02,10.23 73.06,10.23 73.25,10.17 73.27,10.16 73.26,10.15 73.22,10.13 73.07,10.17 73.02,10.19 72.97,10.21
N$62
  cutout Route2: 72.76,10.92 72.77,10.92 72.78,10.92 72.84,10.9 72.87,10.89 72.88,10.89 72.88,10.87 72.83,10.84 72.76,10.88
N$63
  pour Route15: 72.65,10.12 72.86,10.08 73.04,10.01 73.22,9.95 73.42,9.91 73.48,9.9 73.43,9.87 73.29,9.84 73.17,9.85 73.05,9.88 72.94,9.93 72.87,9.97 72.83,9.98 72.76,9.99 72.7,10.01 72.65,10.05 72.63,10.1 72.63,10.12
N$64
  cutout Route2: 72.29,9.98 72.36,10 72.43,9.98 72.51,9.95 72.52,9.95 72.52,9.94 72.52,9.92 72.49,9.91 72.38,9.93 72.3,9.95 72.24,9.96
N$65
  pour Route15: 72.27,9.79 72.58,9.74 72.65,9.72 72.69,9.71 72.66,9.69 72.57,9.66 72.41,9.7 72.27,9.76 72.19,9.8
N$66
  cutout Route2: 72.47,9.55 72.42,9.54 72.4,9.54 72.2,9.59 72.2,9.6 72.2,9.61 72.23,9.62 72.34,9.6 72.36,9.6 72.43,9.57
N$67
  pour Route15: 72.64,9.12 72.49,9.17 72.24,9.23 72.13,9.24 72.24,9.27 72.3,9.28 72.4,9.27 72.49,9.24 72.58,9.2 72.65,9.16 72.74,9.1
N$68
  cutout Route15: 72.84,9.66 72.88,9.67 72.93,9.67 72.97,9.66 73.01,9.64 73.02,9.62 73.01,9.61 72.97,9.6 72.9,9.61 72.85,9.62 72.77,9.63
N$69
  pour Route15: 72.79,9.55 72.98,9.55 72.99,9.56 73.06,9.55 73.16,9.53 73.25,9.5 73.3,9.44 73.32,9.4 73.28,9.42 73.17,9.46 72.97,9.52
N$70
  cutout Route2: 73.01,8.65 73.03,8.67 73.08,8.69 73.14,8.67 73.15,8.66 73.15,8.64 73.11,8.61 73.05,8.63 73.04,8.64
N$71
  cutout Route2: 73.18,8.44 73.17,8.43 73.11,8.43 73.05,8.45 73.05,8.49 73.05,8.5 73.06,8.5 73.19,8.47 73.23,8.44
N$72
  pour Route2: 73.34,8.33 73.33,8.34 73.34,8.35 73.38,8.36 73.45,8.35 73.5,8.31 73.5,8.31 73.5,8.31 73.51,8.33 73.52,8.35 73.54,8.35 73.62,8.33 73.65,8.33 73.71,8.32 73.76,8.27 73.76,8.26 73.76,8.25 73.69,8.22 73.6,8.23 73.5,8.25 73.48,8.26 73.49,8.28 73.49,8.28 73.47,8.29 73.4,8.3
N$73
  cutout Route2: 73.42,8.19 73.42,8.21 73.47,8.24 73.5,8.24 73.52,8.24 73.54,8.24 73.52,8.14 73.51,8.15 73.43,8.18
N$74
  cutout Route2: 73.57,7.94 73.51,7.95 73.44,7.98 73.43,7.99 73.44,8 73.47,8.03 73.54,8 73.6,7.96
N$75
  cutout Route2: 73.86,7.98 73.84,7.95 73.81,7.94 73.81,7.94 73.8,7.92 73.77,7.9 73.72,7.93 73.7,7.95 73.67,7.96 73.69,7.98 73.71,8.01 73.72,8.03 73.86,7.99
N$76
  pour Route15: 74.48,7.88 74.43,7.87 74.28,7.9 74.13,7.95 73.9,8.03 73.87,8.03 73.89,8.06 73.98,8.09 74.05,8.07 74.13,8.03 74.21,7.98 74.32,7.96 74.41,7.94 74.49,7.91 74.53,7.88
N$77
  pour Route15: 74.49,9.17 74.44,9.18 74.39,9.19 74.37,9.18 74.37,9.17 74.35,9.17 74.32,9.18 74.31,9.21 74.23,9.19 74.09,9.22 74.02,9.24 73.95,9.26 74.02,9.28 74.07,9.29 74.07,9.29 73.96,9.32 73.92,9.32 73.94,9.35 73.9,9.35 73.87,9.38 73.85,9.4 73.89,9.4 74.03,9.38 74.13,9.33 74.13,9.32 74.35,9.3 74.39,9.28 74.39,9.28 74.45,9.28 74.49,9.28 74.53,9.27 74.55,9.25 74.56,9.22 74.57,9.2 74.54,9.2 74.54,9.2
N$78
  cutout Route2: 74.74,8.81 74.7,8.8 74.63,8.81 74.58,8.83 74.54,8.83 74.57,8.86 74.61,8.87 74.67,8.86 74.73,8.84 74.77,8.84
N$79
  cutout Route2: 75.05,8.92 75.01,8.91 74.93,8.93 74.86,8.94 74.83,8.94 74.85,8.97 74.91,9 75.02,8.97 75.05,8.95 75.08,8.94
N$80
  cutout Route2: 71.78,6.47 71.7,6.45 71.64,6.46 71.57,6.5 71.52,6.54 71.49,6.58 71.47,6.61 71.5,6.61 71.58,6.6 71.66,6.56 71.77,6.51 71.8,6.5
N$81
  cutout Route2: 71.48,6.17 71.4,6.19 71.35,6.21 71.28,6.22 71.35,6.25 71.4,6.26 71.44,6.26 71.47,6.24 71.49,6.22 71.5,6.19 71.5,6.17
N$82
  cutout Route2: 75.47,8.55 75.63,8.54 75.66,8.54 75.65,8.51 75.59,8.49 75.51,8.5 75.48,8.51 75.41,8.52
N$83
  cutout Route2: 75.69,8.41 75.68,8.39 75.63,8.37 75.59,8.37 75.54,8.4 75.55,8.44 75.55,8.45 75.56,8.45 75.62,8.43 75.66,8.41
N$84
  cutout Route2: 75.39,7.57 75.44,7.59 75.55,7.55 75.63,7.52 75.67,7.51 75.63,7.49 75.58,7.47 75.47,7.51 75.41,7.54 75.35,7.54
N$85
  pour Route15: 72.93,6.75 73.04,6.71 73.16,6.68 73.27,6.66 73.37,6.62 73.38,6.61 73.37,6.59 73.33,6.57 73.28,6.58 73.25,6.59 73.23,6.58 73.22,6.56 73.2,6.58 73.14,6.62 73.07,6.63 73.02,6.63 72.97,6.64 72.93,6.67 72.9,6.73 72.88,6.78
N$86
  pour Route2: 72.88,6.58 72.99,6.59 73.02,6.58 73.06,6.57 73.03,6.55 72.95,6.52 72.89,6.51 72.87,6.5 72.87,6.53
N$87
  cutout Route2: 72.75,6.74 72.66,6.76 72.65,6.78 72.69,6.78
N$88
  cutout Route2: 72.49,6.68 72.56,6.67 72.6,6.67 72.58,6.64 72.53,6.61 72.48,6.63 72.43,6.65 72.41,6.65 72.41,6.67 72.42,6.69
N$89
  cutout Route2: 72.32,7.08 72.33,7.11 72.33,7.13 72.35,7.13 72.4,7.11 72.41,7.1 72.43,7.09 72.42,7.08 72.38,7.03 72.36,7.02 72.36,7 72.34,7 72.32,7.02
N$90
  cutout Route2: 72.08,7.18 72.1,7.2 72.11,7.21 72.11,7.24 72.14,7.22 72.18,7.21 72.25,7.19 72.25,7.15 72.25,7.13 72.2,7.14 72.19,7.11 72.18,7.11 72.17,7.1 72.16,7.1 72.12,7.12 72.1,7.14 72.09,7.15 72.05,7.16
N$91
  cutout Route2: 72.14,5.88 72.11,5.86 72.11,5.86 72.1,5.84 72.09,5.85 72.04,5.87 72.03,5.9 72,5.93 71.99,5.93 71.98,5.96 72.04,5.98 72.1,5.97 72.11,5.95 72.1,5.94 72.11,5.93 72.14,5.89 72.15,5.88
N$92
  cutout Route2: 72.43,6.12 72.4,6.1 72.41,6.09 72.39,6.09 72.38,6.08 72.37,6.09 72.35,6.1 72.32,6.1 72.2,6.14 72.19,6.18 72.19,6.19 72.35,6.16 72.36,6.2 72.37,6.22 72.39,6.21 72.42,6.17 72.42,6.14 72.42,6.13 72.43,6.13
N$93
  pour Route15: 72.08,6.42 72,6.46 72.01,6.49 72.73,6.25 72.83,6.21 72.72,6.22 72.55,6.24 72.39,6.28 72.23,6.35
N$94
  cutout Route2: 73.01,5.6 72.74,5.69 72.7,5.72 72.75,5.73 72.78,5.73 72.85,5.72 72.93,5.71 72.99,5.67 73.03,5.62 73.03,5.6
N$95
  cutout Route15: 73.07,5.93 73,5.95 72.96,5.95 72.97,5.97 72.95,5.96 72.89,5.97 72.85,6 72.84,6.04 72.86,6.07 72.88,6.05 72.93,6.03 73,6 73,6 73.09,5.99 73.16,5.97 73.2,5.97 73.17,5.94 73.13,5.92
N$96
  cutout Route2: 73.31,5.31 73.25,5.28 73.17,5.32 73.15,5.34 73.18,5.35 73.24,5.36 73.32,5.33 73.33,5.32
N$97
  pour Route15: 73.86,5.75 73.53,5.81 73.28,5.87 73.13,5.9 73.28,5.91 73.43,5.9 73.6,5.87 73.75,5.83 73.87,5.79 73.96,5.75
N$98
  pour Route15: 73.85,6.36 73.62,6.37 73.41,6.42 73.39,6.43 73.39,6.44 73.31,6.42 73.2,6.44 73.07,6.52 73.04,6.54 73.08,6.55 73.24,6.52 73.4,6.49 73.44,6.49 73.44,6.48 73.45,6.48 73.58,6.44 73.59,6.43 73.88,6.46 74.2,6.41 74.29,6.38 74.12,6.37
N$99
  cutout Route2: 74.56,5.36 74.49,5.34 74.43,5.34 74.34,5.36 74.27,5.39 74.24,5.42 74.23,5.44 74.25,5.44 74.44,5.41 74.55,5.39 74.58,5.38
N$100
  pour Route15: 74.67,6.02 74.64,6 74.6,6.01 74.57,6.01 74.54,6.01 74.55,6.04 74.59,6.08 74.58,6.08 74.52,6.08 74.48,6.12 74.47,6.13 74.47,6.13 74.38,6.11 74.19,6.16 74.17,6.17 74.19,6.19 74.24,6.21 74.29,6.2 74.33,6.19 74.35,6.2 74.33,6.22 74.3,6.25 74.29,6.31 74.29,6.33 74.31,6.32 74.37,6.28 74.41,6.24 74.44,6.19 74.49,6.18 74.54,6.17 74.52,6.16 74.56,6.17 74.73,6.12 74.75,6.11 74.75,6.1 74.72,6.06 74.67,6.04 74.68,6.04
N$101
  cutout Route2: 74.98,5.6 74.93,5.59 74.84,5.6 74.75,5.62 74.68,5.63 74.74,5.66 74.79,5.67 74.85,5.67 74.92,5.66 74.98,5.63 75,5.62
N$102
  pour Route15: 75.17,6.82 75.17,6.82 75.11,6.85 75.05,6.85 75.1,6.88 75.1,6.88 75.08,6.91 75.09,6.95 75.1,6.97 75.12,6.96 75.28,6.89 75.49,6.79 75.53,6.77 75.48,6.76 75.46,6.76 75.35,6.78 75.26,6.8 75.2,6.79
N$103
  cutout Route2: 75.64,6.35 75.6,6.32 75.57,6.33 75.55,6.33 75.56,6.35 75.57,6.39 75.52,6.42 75.48,6.42 75.51,6.45 75.64,6.46 75.65,6.45 75.65,6.43 75.63,6.41
N$104
  pour Route15: 75.67,6.05 75.64,6.03 75.48,6 75.26,6.03 75.2,6.06 75.26,6.07 75.37,6.08 75.41,6.08 75.59,6.1 75.59,6.1 75.6,6.1 75.64,6.09 75.68,6.08 75.65,6.06 75.65,6.06
N$105
  cutout Route2: 75.66,7.28 75.6,7.27 75.52,7.3 75.51,7.31 75.51,7.32 75.55,7.35 75.59,7.34 75.64,7.32 75.74,7.33
N$106
  cutout Route2: 75.75,7.75 75.75,7.76 75.75,7.76 75.75,7.76 75.76,7.76 75.83,7.76 75.85,7.76 75.85,7.74 75.83,7.72 75.87,7.72 75.89,7.72 75.92,7.72 75.9,7.63 75.88,7.64 75.84,7.66 75.78,7.69
N$107
  cutout Route2: 75.98,7.18 75.97,7.17 75.96,7.17 75.88,7.19 75.84,7.21 75.82,7.21 75.83,7.23 75.88,7.26 75.96,7.22
N$108
  cutout Route2: 76.58,6.54 76.58,6.53 76.58,6.52 76.54,6.5 76.46,6.53 76.47,6.57 76.47,6.58 76.48,6.58
N$109
  cutout Route2: 76.88,7.58 76.93,7.57 76.95,7.54 76.94,7.52 76.93,7.52 76.9,7.52 76.88,7.53 76.82,7.54 76.67,7.56 76.64,7.57 76.61,7.59 76.6,7.59 76.57,7.6 76.59,7.63 76.66,7.64 76.75,7.61 76.88,7.58
N$110
  pour Route15: 69.48,8.56 69.63,8.53 69.5,8.56
N$111
  cutout Route2: 76.1,9.91 76.26,9.79 76.3,9.8 76.36,9.79 76.4,9.84 76.35,9.84
N$112
  cutout Route2: 56.8,11.68 56.9,11.65 56.8,11.64 56.75,11.64 56.52,11.66 56.28,11.71 55.92,9.8 55.92,9.8 55.94,9.79 55.95,9.79 55.99,9.78 56.81,9.6 57.6,9.42 57.65,9.41 57.84,10.41 57.77,10.43 57.72,10.43 57.77,10.46 57.85,10.46 57.98,11.15 57.96,11.14 57.83,11.18 57.69,11.21 57.63,11.2 57.67,11.24 57.71,11.26 57.76,11.26 57.82,11.25 57.88,11.23 57.99,11.2 58.1,11.77 56.45,11.77
N$113
  cutout Route2: 56.61,10.65 56.61,10.67 56.82,10.62 56.81,10.6 56.75,10.57 56.62,10.62
N$114
  cutout Route2: 56.14,10.54 56.13,10.54 56.13,10.52 56.1,10.54 56.09,10.58 56.13,10.6 56.22,10.58 56.23,10.58 56.23,10.56 56.18,10.52
N$115
  cutout Route2: 56.34,10.48 56.24,10.51 56.2,10.51 56.23,10.54 56.28,10.55 56.36,10.53 56.49,10.5 56.54,10.5 56.51,10.47 56.44,10.44
N$116
  cutout Route2: 56.69,9.82 56.61,9.8 56.51,9.83 56.5,9.87 56.5,9.89 56.71,9.84
N$117
  pour Route2: 57.24,9.57 57.18,9.53 57.17,9.53 57.15,9.54 57.16,9.56 57.17,9.6 57.13,9.59 57.07,9.57 57.11,9.62 57.16,9.65 57.23,9.66 57.24,9.66 57.24,9.65
N$118
  cutout Route2: 57.57,9.47 57.47,9.48 57.43,9.49 57.46,9.5
N$119
  cutout Route2: 57.72,11.3 57.68,11.27 57.62,11.26 57.53,11.29 57.52,11.29 57.52,11.3 57.52,11.32 57.6,11.32 57.67,11.31
N$120
  cutout Route2: 57.62,11.67 57.53,11.67 57.49,11.68 57.52,11.69
N$121
  pour Route15: 57.02,10.49 57.21,10.47 57.38,10.41 57.57,10.36 57.67,10.33 57.57,10.32 57.54,10.32 57.28,10.38 57.02,10.45
N$122
  pour Route15: 57.35,10.27 57.41,10.25 57.43,10.25 57.66,10.21 57.71,10.2 57.77,10.17 57.77,10.14 57.43,10.2 57.4,10.23 57.33,10.24 57.15,10.27 56.95,10.32 56.74,10.38 56.54,10.45 56.56,10.49 56.92,10.39
N$123
  cutout Route2: 43.33,13.76 43.31,13.76 43.32,13.75
N$124
  cutout Route2: 59.23,9.68 58.92,9.8 58.9,9.7 58.91,9.7 59.01,9.67 59.03,9.67 59.03,9.65 58.96,9.61 58.89,9.63 58.87,9.56 58.98,9.53 59.07,9.5 58.98,9.49 58.93,9.49 58.86,9.49 58.78,9.04 58.81,9.04 58.89,9.02 58.96,9.01 59.03,8.98 59.09,8.95 59.14,8.89 59.14,8.89 59.24,8.92 59.35,8.92 59.4,8.92 59.36,8.89 59.35,8.88 59.48,8.83 59.7,8.78 59.99,8.69 59.99,8.69 60.03,8.72 60.05,8.72 60.05,8.71 60.14,8.65 60.27,8.62 60.35,8.6 60.39,8.59 60.35,8.57 60.27,8.55 60.12,8.58 59.98,8.63 59.97,8.64 59.59,8.73 59.36,8.78 59.15,8.85 59.16,8.83 59.12,8.85 58.76,8.98 58.73,8.81 59.1,8.75 59.48,8.66 59.85,8.56 60.23,8.44 60.45,8.38 60.44,8.34 60.25,8.39 58.72,8.77 58.63,8.26 58.64,8.26 58.71,8.25 58.73,8.25 58.72,8.23 58.65,8.18 58.62,8.19 58.59,8.03 58.84,7.95 59.02,7.89 59.03,7.89 59.03,7.88 59.04,7.85 59.05,7.84 59.34,7.75 59.65,7.67 59.97,7.59 60.29,7.54 60.33,7.71 60.32,7.71 60.32,7.73 60.33,7.75 60.33,7.75 60.41,8.17 60.38,8.18 60.42,8.18 60.42,8.19 60.42,8.2 60.42,8.2 60.47,8.47 60.42,8.49 60.48,8.51 60.52,8.71 60.49,8.69 60.45,8.68 60.37,8.69 60.31,8.71 60.27,8.71 60.3,8.74 60.35,8.75 60.42,8.74 60.48,8.72 60.52,8.72 60.6,9.16 60.57,9.17 60.49,9.19 60.42,9.22 60.36,9.25 60.3,9.31 60.27,9.33 60.31,9.34 60.47,9.33 60.62,9.28 60.63,9.32 60.36,9.38 60.26,9.41 60.2,9.43 59.72,9.55 59.3,9.66 59.31,9.65 59.33,9.64 59.32,9.62 59.28,9.6 59.25,9.6 59.2,9.61 59.18,9.6 59.18,9.63 59.2,9.67
N$125
  cutout Route2: 59.97,8.3 60,8.31 60.11,8.3 60.2,8.25 60.21,8.22 60.21,8.19 60.19,8.21 60.09,8.24 59.98,8.27 59.97,8.27 59.96,8.28
N$126
  pour Route15: 59.16,8.5 59.24,8.51 59.3,8.51 59.35,8.5 59.39,8.48 59.41,8.44 59.43,8.45 59.61,8.42 59.72,8.4 59.81,8.39 59.72,8.36 59.68,8.36 59.54,8.39 59.44,8.41 59.34,8.42 59.36,8.43 59.17,8.47 59.17,8.47 59.16,8.49
N$127
  cutout Route2: 58.81,8.19 58.85,8.2 58.92,8.19 58.98,8.17 59.05,8.17 58.99,8.14 58.91,8.12 58.81,8.16 58.79,8.18
N$128
  cutout Route2: 58.98,8 58.91,7.97 58.87,7.98 58.83,7.99 58.8,8.02 58.78,8.05 58.78,8.07 58.8,8.1 58.82,8.11 58.83,8.1 58.86,8.06 58.89,8.04 58.93,8.03 58.96,8.03 58.99,8.03
N$129
  pour Route15: 59.4,8.02 59.31,8.05 59.27,8.04 59.13,8.07 59,8.1 58.94,8.11 58.99,8.14 59.07,8.16 59.21,8.12 59.31,8.08 59.35,8.07 59.32,8.05 59.41,8.06 59.54,8.05 59.66,8.01 59.89,7.95 59.99,7.94 59.89,7.91 59.82,7.9 59.68,7.93 59.55,7.97
N$130
  pour Route15: 60.18,7.77 60.12,7.76 59.95,7.8 59.74,7.84 59.66,7.84 59.72,7.87 59.79,7.89 59.98,7.85 60.17,7.81 60.27,7.79
N$131
  cutout Route2: 60.2,9.31 60.21,9.32 60.22,9.32 60.3,9.28 60.3,9.23 60.29,9.22 60.28,9.22 60.26,9.22 60.19,9.25
N$132
  cutout Route2: 60.13,8.83 60.15,8.82 60.14,8.81 60.08,8.78 60,8.82 60,8.83 60,8.83 60.05,8.87 60.12,8.84
N$133
  cutout Route15: 59.87,9.12 59.91,9.13 59.96,9.13 60.01,9.11 60.07,9.09 60.09,9.08 60.07,9.06 60.03,9.04 59.96,9.06 59.88,9.08 59.82,9.08
N$134
  cutout Route2: 59.57,8.98 59.65,8.97 59.74,8.94 59.83,8.9 59.91,8.85 59.97,8.82 59.9,8.82 59.69,8.88 59.51,8.93 59.5,8.93 59.49,8.96
N$135
  cutout Route2: 54.5,11.54 54.48,11.55 54.48,11.55 54.26,11.64 54.05,11.71 53.83,11.77 53.62,11.82 53.2,11.87 52.79,11.88 52.54,11.87 52.38,11.64 52.19,11.43 52.22,11.42 52.19,11.4 52.14,11.38 52.13,11.38 52.12,11.36 52.34,11.26 52.61,11.18 53.04,11.03 53.1,11 53.17,11.02 53.25,11.01 53.31,11 53.3,10.98 53.23,10.94 53.14,10.96 53.09,10.97 53.04,10.98 53.09,11 53.09,11 53.03,11 52.98,11 52.74,11.03 52.49,11.11 52.26,11.17 52.04,11.21 51.98,11.24 51.75,11.08 51.7,11.05 51.91,10.99 52.23,10.92 52.36,10.9 52.23,10.88 52.17,10.88 52.27,10.85 52.43,10.81 52.51,10.8 52.43,10.77 52.35,10.76 52.17,10.8 52.04,10.83 51.99,10.84 52.04,10.87 52.09,10.88 51.88,10.93 51.61,10.99 51.6,10.99 51.34,10.88 51.07,10.79 50.79,10.74 50.5,10.73 50.3,10.74 50.54,10.69 50.76,10.6 50.8,10.59 50.76,10.57 50.7,10.55 50.78,10.52 50.82,10.5 50.84,10.5 50.84,10.48 50.83,10.45 50.89,10.43 50.92,10.39 50.92,10.38 50.92,10.37 50.87,10.36 50.78,10.4 50.77,10.43 50.67,10.46 50.59,10.52 50.57,10.54 50.59,10.55 50.6,10.55 50.5,10.56 50.4,10.59 50.31,10.63 50.23,10.67 50.09,10.42 49.98,10.15 50.05,10.14 50.11,10.12 50.17,10.09 50.22,10.04 50.24,10.03 50.45,10.01 50.67,9.96 50.9,9.9 51.14,9.84 51.48,9.74 51.52,9.73 51.81,9.66 51.75,9.74 51.5,9.85 51.5,9.85 51.49,9.82 51.47,9.82 51.45,9.83 51.4,9.85 51.41,9.89 51.42,9.91 51.43,9.9 51.45,9.9 51.49,9.9 51.51,9.9 51.5,9.88 51.51,9.88 51.72,9.86 51.73,9.95 51.73,9.97 51.76,10.05 51.8,10.13 51.86,10.19 51.93,10.25 52.03,10.3 52.14,10.34 52.26,10.37 52.41,10.38 52.36,10.41 52.24,10.44 52.15,10.46 52.08,10.51 52.05,10.54 52.09,10.54 52.14,10.53 52.22,10.52 52.31,10.49 52.38,10.44 52.4,10.45 52.46,10.46 52.57,10.43 52.64,10.41 52.71,10.4 52.65,10.38 52.83,10.36 53.01,10.32 53.19,10.27 53.37,10.21 53.54,10.13 53.71,10.04 53.88,9.94 54.05,9.83 54.25,10.06 54.43,10.31 54.6,10.56 54.75,10.83 54.61,10.91 54.59,10.92 54.61,10.93 54.66,10.95 54.72,10.93 54.78,10.89 54.78,10.89 54.8,10.93 54.74,10.96 54.61,11.06 54.76,11 54.82,10.98 54.96,11.29 54.56,11.52
N$136
  cutout Route2: 50.18,10.34 50.13,10.35 50.09,10.36 50.13,10.38 50.22,10.39 50.34,10.37 50.44,10.35 50.5,10.34 50.44,10.31 50.38,10.3
N$137
  cutout Route2: 50.52,10.11 50.51,10.1 50.39,10.13 50.32,10.15 50.25,10.16 50.31,10.19 50.38,10.2 50.46,10.18 50.53,10.14 50.57,10.11
N$138
  pour Route15: 50.8,10.23 50.75,10.21 50.63,10.24 50.55,10.27 50.49,10.27 50.54,10.3 50.58,10.31 50.75,10.27 50.8,10.26 50.84,10.25
N$139
  cutout Route2: 51.14,9.98 51.1,9.96 51,9.98 50.97,9.99 51,10.01 51.04,10.03 51.09,10.02 51.11,10.02 51.12,10.03 51.13,10.01
N$140
  cutout Route2: 51.34,10.1 51.3,10.06 51.25,10.08 51.21,10.1 51.18,10.1 51.19,10.13 51.24,10.16 51.29,10.14 51.33,10.12 51.35,10.12
N$141
  pour Route15: 52.64,10.83 52.82,10.81 52.97,10.79 52.99,10.79 53,10.79 53.01,10.79 53.01,10.75 53.01,10.73 52.99,10.73 52.96,10.73 52.83,10.75 52.73,10.78 52.69,10.79 52.59,10.81
N$142
  pour Route15: 53.13,10.31 53.11,10.31 52.9,10.36 52.76,10.41 52.62,10.44 52.61,10.44 52.61,10.45 52.55,10.49 52.45,10.52 52.34,10.55 52.26,10.61 52.11,10.64 51.99,10.67 51.88,10.72 51.78,10.77 51.74,10.79 51.78,10.8 51.85,10.82 52,10.78 52.17,10.72 52.38,10.64 52.44,10.62 52.54,10.59 52.62,10.54 52.62,10.54 52.7,10.53 52.79,10.5 52.87,10.47 52.95,10.43 53.13,10.34 53.21,10.31
N$143
  pour Route15: 53.25,11.44 53.31,11.45 53.46,11.41 53.49,11.39 53.46,11.37 53.41,11.36 53.34,11.38 53.26,11.4 53.2,11.41
N$144
  pour Route15: 53.3,11.15 53.2,11.18 53.13,11.2 53.12,11.2 53.12,11.22 53.12,11.24 53.15,11.25 53.26,11.22 53.34,11.21 53.38,11.2 53.35,11.17
N$145
  pour Route2: 53.49,10.57 53.47,10.58 53.34,10.61 53.32,10.6 53.32,10.62 53.32,10.66 53.36,10.67 53.48,10.63 53.49,10.59
N$146
  cutout Route2: 53.85,10.34 53.83,10.29 53.79,10.26 53.76,10.26 53.76,10.27 53.75,10.27 53.75,10.33 53.83,10.36 53.85,10.36
N$147
  pour Route15: 53.99,11.04 53.88,11 53.85,11 53.81,11.01 53.84,11.03 53.72,11.04 53.6,11.08 53.57,11.1 53.6,11.11 53.69,11.13 53.95,11.08 54.02,11.06
N$148
  cutout Route2: 54.61,11.41 54.62,11.41 54.63,11.41 54.71,11.38 54.72,11.35 54.68,11.33 54.55,11.37 54.55,11.36 54.53,11.38 54.53,11.38 54.51,11.38 54.51,11.39 54.46,11.43 54.49,11.43 54.48,11.43 54.51,11.43 54.51,11.44 54.52,11.43 54.54,11.42 54.55,11.41 54.55,11.41
N$149
  cutout Route2: 56.21,9.68 55.91,9.75 55.71,8.69 56.22,8.57 56.27,8.56 56.27,8.53 56.08,8.53 55.96,8.52 55.84,8.53 55.79,8.55 55.76,8.54 55.68,8.55 55.63,8.26 55.76,8.23 55.91,8.2 56,8.19 55.96,8.18 56.79,7.99 57.08,7.92 57.16,7.9 57.08,7.88 56.89,7.91 56.79,7.93 56.81,7.92 56.83,7.91 56.88,7.89 56.82,7.88 56.77,7.87 56.49,7.93 56.39,7.96 56.34,7.98 56.39,8 56.48,8.01 56.29,8.05 56.09,8.09 55.92,8.15 55.89,8.16 55.83,8.16 55.61,8.19 55.49,7.52 57.17,7.11 57.22,7.1 57.35,7.79 57.29,7.81 57.17,7.84 57.13,7.85 57.16,7.87 57.2,7.88 57.36,7.85 57.41,8.1 57.33,8.11 57.33,8.11 57.32,8.11 57.31,8.14 57.32,8.15 57.11,8.21 57.1,8.18 57.06,8.17 56.98,8.19 56.92,8.21 56.94,8.23 56.99,8.24 56.89,8.27 56.87,8.27 56.86,8.26 56.8,8.22 56.78,8.23 56.78,8.25 56.72,8.27 56.72,8.28 56.74,8.31 56.59,8.33 56.59,8.31 56.58,8.3 56.58,8.29 56.56,8.29 56.26,8.36 56.24,8.36 56.24,8.38 56.24,8.39 56.21,8.38 56.19,8.4 56.18,8.41 56.12,8.41 56.06,8.42 56.04,8.42 56.05,8.45 55.95,8.45 55.93,8.46 55.95,8.48 56.02,8.51 56.11,8.53 56.47,8.46 56.69,8.4 56.84,8.37 57.02,8.33 57.19,8.29 57.32,8.24 57.43,8.23 57.43,8.24 57.42,8.25 57.36,8.27 57.32,8.28 57.36,8.3 57.4,8.31 57.45,8.31 57.53,8.75 57.42,8.78 57.35,8.8 57.33,8.81 57.34,8.83 57.41,8.87 57.54,8.84 57.55,8.84 57.64,9.33 57.02,9.48 56.82,9.51 56.62,9.56 56.42,9.61
N$150
  cutout Route2: 56.29,9.11 56.24,9.11 56.01,9.16 55.86,9.2 55.85,9.2 55.85,9.2 55.84,9.23 55.86,9.25 55.89,9.24 55.93,9.24 55.92,9.28 55.95,9.26 56.17,9.18 56.29,9.15 56.35,9.13
N$151
  cutout Route2: 56.65,9.49 56.53,9.51 56.42,9.53 56.53,9.55 56.72,9.52 56.84,9.49 56.95,9.48 56.84,9.46 56.81,9.45
N$152
  cutout Route2: 56.74,9.05 56.73,9.09 56.73,9.11 56.94,9.06 56.94,9.04 56.87,9.01
N$153
  cutout Route2: 57.27,8.36 57.24,8.32 57.24,8.3 57.11,8.33 57.14,8.35 57.2,8.41 57.27,8.47 57.29,8.49 57.3,8.47 57.31,8.43 57.31,8.4 57.29,8.38
N$154
  cutout Route2: 57.23,8.91 57.31,8.9 57.34,8.89 57.32,8.87 57.25,8.83 57.16,8.86 57.04,8.88 56.91,8.85 57.03,8.91 57.12,8.93
N$155
  cutout Route2: 58.07,5.27 58.08,5.27 58.07,5.27
N$156
  cutout Route2: 277 corners
N$157
  pour Route2: 52.37,6.03 52.5,5.98 52.52,5.97 52.5,5.96 52.46,5.94 52.39,5.96 52.33,5.97 52.29,5.98 52.32,6
N$158
  cutout Route2: 50.27,5.99 50.28,6 50.34,6 50.39,5.98 50.46,5.96 50.5,5.95 50.47,5.93 50.4,5.9 50.29,5.94 50.27,5.98
N$159
  pour Route2: 50.03,6.64 50.05,6.63 50.04,6.61 50.01,6.57 49.97,6.57 49.93,6.57 49.88,6.57 49.83,6.57 49.87,6.61 49.87,6.61 49.87,6.61 49.87,6.63 49.92,6.66 49.98,6.65
N$160
  cutout Route2: 49.96,6.73 49.94,6.71 49.84,6.68 49.8,6.68 49.76,6.7 49.74,6.72 49.73,6.74 49.73,6.76 49.75,6.76 49.9,6.74
N$161
  cutout Route2: 49.71,7.35 49.73,7.38 49.77,7.39 49.79,7.39 49.8,7.41 49.82,7.4 49.84,7.37 49.84,7.36 49.86,7.36 49.85,7.34 49.8,7.31 49.75,7.32 49.72,7.33 49.7,7.33
N$162
  cutout Route2: 49.89,5.93 49.83,5.93 49.63,5.98 49.59,6 49.63,6.01 49.79,5.99 49.89,5.97 49.98,5.96
N$163
  cutout Route2: 49.99,6.06 49.99,6.05 49.99,6.05 49.95,6.02 49.87,6.07 49.86,6.07 49.87,6.08 49.9,6.1 49.92,6.1 49.9,6.11 49.89,6.12 49.9,6.14 49.93,6.16 50,6.12 49.99,6.07 49.99,6.06
N$164
  pour Route15: 50.89,5.54 50.78,5.5 50.64,5.54 50.54,5.56 50.48,5.54 50.46,5.53 50.45,5.55 50.37,5.61 50.26,5.65 50.2,5.67 50.13,5.69 50.08,5.72 50.03,5.77 50,5.81 50.05,5.8 50.4,5.69 50.66,5.61 50.87,5.57 50.92,5.57
N$165
  cutout Route2: 50.79,5.8 50.79,5.82 50.86,5.86 50.93,5.83 50.94,5.82 50.94,5.81 50.89,5.78 50.84,5.79 50.81,5.79
N$166
  cutout Route2: 51,5.37 50.98,5.37 50.98,5.34 50.96,5.35 50.93,5.38 50.92,5.39 50.91,5.39 50.91,5.41 50.96,5.44 51.01,5.44 51.03,5.43 51.04,5.43 51.04,5.41 51.02,5.37
N$167
  pour Route15: 51.15,5.75 51.11,5.74 51.04,5.76 50.99,5.77 50.95,5.77 50.98,5.8 51.02,5.81 51.08,5.8 51.14,5.79 51.18,5.78
N$168
  cutout Route2: 51.01,6.28 51.01,6.3 51.03,6.33 51.04,6.35 51.04,6.37 51.06,6.37 51.09,6.36 51.1,6.34 51.11,6.31 51.11,6.29 51.11,6.28 51.11,6.26 51.08,6.26 51.03,6.28
N$169
  pour Route2: 51.54,5.33 51.53,5.29 51.51,5.3 51.43,5.3 51.33,5.31 51.24,5.34 51.23,5.36 51.24,5.37 51.24,5.38 51.21,5.39 51.26,5.41 51.43,5.38 51.53,5.36 51.57,5.35 51.54,5.33
N$170
  cutout Route15: 51.56,5.72 51.5,5.7 51.42,5.73 51.42,5.72 51.41,5.7 51.4,5.7 51.34,5.73 51.33,5.78 51.34,5.8 51.35,5.8 51.41,5.77 51.46,5.79 51.56,5.75 51.59,5.73
N$171
  cutout Route2: 51.52,6.3 51.49,6.29 51.44,6.29 51.4,6.29 51.41,6.32 51.45,6.34 51.47,6.35 51.47,6.37 51.49,6.37 51.52,6.36 51.53,6.34 51.53,6.33 51.63,6.3
N$172
  cutout Route2: 51.83,6.22 51.77,6.2 51.7,6.21 51.64,6.24 51.64,6.26 51.65,6.27 51.69,6.29 51.75,6.27 51.8,6.26 51.82,6.27 51.83,6.26
N$173
  pour Route15: 51.78,6.32 51.6,6.36 51.52,6.39 51.05,6.51 50.75,6.58 50.73,6.59 50.73,6.61 50.77,6.63 50.78,6.63 50.78,6.63 50.94,6.61 51.09,6.58 51.24,6.54 51.38,6.5 51.89,6.39 51.94,6.38 51.89,6.35
N$174
  pour Route15: 51.91,6.16 51.93,6.18 51.96,6.2 52,6.21 52.04,6.22 52.18,6.19 52.28,6.14 52.3,6.12 52.28,6.11 52.21,6.1 52.17,6.1 52.19,6.08 52.22,6.05 52.27,6.04 52.23,6.02 52.19,6.01 52.14,6.03 52.12,6.04 52.11,6.03 52.08,6.01 52.08,6.05 52.1,6.1 52.11,6.11 52.11,6.11 52.1,6.12 51.93,6.13 51.89,6.12
N$175
  pour Route15: 52.46,5.4 52.4,5.39 52.28,5.43 52.21,5.45 52.2,5.45 52.19,5.47 52.17,5.51 52.14,5.53 52.11,5.54 52.07,5.54 52.03,5.54 51.95,5.54 51.91,5.55 51.94,5.58 51.95,5.61 51.93,5.66 51.91,5.67 51.92,5.68 51.96,5.71 51.99,5.72 52.04,5.71 52.06,5.71 52.06,5.69 52.08,5.65 52.09,5.63 52.12,5.63 52.2,5.61 52.21,5.61 52.21,5.6 52.21,5.58 52.44,5.5 52.46,5.49 52.46,5.47 52.44,5.45 52.44,5.44 52.45,5.43 52.53,5.43
N$176
  cutout Route2: 54.32,8 54.36,7.99 54.45,7.95 54.49,7.97 54.54,7.96 54.55,7.96 54.55,7.94 54.49,7.89 54.44,7.92 54.39,7.89 54.36,7.9 54.33,7.92 54.31,7.94 54.3,7.98 54.29,8
N$177
  cutout Route2: 53.83,8.37 53.85,8.41 53.85,8.43 53.87,8.42 53.89,8.41 53.9,8.42 53.96,8.41 54,8.4 53.96,8.38 53.93,8.35 53.91,8.31 53.86,8.3 53.84,8.3 53.83,8.3 53.83,8.31
N$178
  cutout Route2: 53.79,8.09 53.85,8.12 53.93,8.1 53.99,8.09 54.03,8.08 54,8.06 53.94,8.03 53.89,8.04 53.81,8.06 53.76,8.06
N$179
  cutout Route2: 53.48,9.02 53.56,9.04 53.66,9.02 53.68,9.01 53.67,8.99 53.62,8.96 53.54,8.98 53.49,8.99 53.38,9
N$180
  cutout Route2: 53,8.03 53.09,8.02 53.11,8.01 53.08,8
N$181
  pour Route15: 53.09,9.04 53.1,9.04 53.1,9.03 53.08,8.97 53.07,8.96 53.07,8.92 53.04,8.94 52.96,8.98 52.86,8.99 52.76,9.01 52.67,9.05 52.58,9.03 52.51,9.04 52.43,9.06 52.36,9.09 52.3,9.13 52.27,9.16 52.32,9.16 52.51,9.15 52.69,9.12 52.89,9.09
N$182
  cutout Route2: 52.57,8.27 52.59,8.29 52.62,8.3 52.69,8.27 52.74,8.24 52.78,8.24 52.76,8.21 52.67,8.16 52.58,8.22 52.57,8.22 52.57,8.23 52.59,8.26
N$183
  cutout Route2: 52.17,9.22 52.18,9.27 52.19,9.29 52.21,9.28 52.27,9.25 52.35,9.21 52.36,9.2 52.34,9.19 52.29,9.18 52.24,9.18
N$184
  pour Route2: 52.14,9.4 52.26,9.42 52.34,9.41 52.42,9.38 52.44,9.37 52.43,9.35 52.39,9.32 52.34,9.32 52.32,9.32 52.3,9.32 52.3,9.27 52.27,9.31 52.21,9.34 52.14,9.37 52.1,9.38
N$185
  pour Route15: 51.97,9.01 52.08,9.02 52.22,9 52.39,8.96 52.46,8.95 52.4,8.93 52.31,8.91 52.14,8.94 51.98,8.98 51.9,8.97
N$186
  pour Route2: 51.59,8.5 51.65,8.53 51.77,8.5 51.85,8.45 51.92,8.37 51.82,8.42 51.74,8.43 51.59,8.47 51.58,8.48
N$187
  pour Route15: 50.69,9.71 50.77,9.71 50.84,9.68 50.91,9.65 50.96,9.6 50.98,9.56 50.94,9.57 50.76,9.6 50.6,9.66 50.55,9.68 50.6,9.7
N$188
  pour Route2: 50.65,9.6 50.63,9.51 50.61,9.52 50.59,9.53 50.54,9.55 50.55,9.59 50.55,9.6 50.56,9.6 50.63,9.6
N$189
  cutout Route2: 50.47,9.73 50.5,9.76 50.56,9.75 50.6,9.74 50.56,9.72 50.55,9.7 50.5,9.67 50.48,9.67 50.47,9.68 50.47,9.68
N$190
  pour Route15: 50.24,9.4 50.3,9.42 50.38,9.43 50.47,9.42 50.57,9.4 50.68,9.36 50.75,9.33 50.68,9.32 50.64,9.32 50.3,9.38
N$191
  cutout Route2: 50.37,8.47 50.36,8.45 50.35,8.46 50.28,8.47 50.26,8.48 50.26,8.49 50.27,8.53 50.3,8.54 50.3,8.54 50.3,8.59 50.34,8.55 50.37,8.52
N$192
  cutout Route2: 50.5,8.59 50.46,8.59 50.49,8.62 50.56,8.63 50.64,8.61 50.75,8.58 50.84,8.6 50.76,8.55 50.7,8.53 50.59,8.56
N$193
  cutout Route2: 50.9,8.41 50.89,8.39 50.85,8.37 50.76,8.39 50.67,8.41 50.64,8.42 50.66,8.44 50.72,8.47 50.81,8.45 50.89,8.43 50.91,8.43
N$194
  pour Route15: 51.73,8.29 51.72,8.29 51.72,8.27 51.71,8.28 51.55,8.32 51.52,8.32 51.53,8.33 51.37,8.35 51.23,8.39 51.21,8.4 51.19,8.4 51.15,8.41 51.12,8.42 51.1,8.42 51.1,8.42 51.08,8.42 50.99,8.45 50.9,8.48 50.86,8.5 50.9,8.52 50.94,8.52 51.02,8.51 51.1,8.47 51.11,8.46 51.11,8.48 51.13,8.48 51.21,8.46 51.23,8.46 51.23,8.44 51.22,8.42 51.23,8.42 51.29,8.43 51.48,8.39 51.54,8.37 51.56,8.36 51.6,8.37 51.68,8.36 51.73,8.32 51.73,8.3 51.75,8.32 51.82,8.33 51.9,8.32 51.97,8.31 52.01,8.31 51.98,8.28 51.97,8.28 51.99,8.27 51.95,8.25 51.89,8.24 51.8,8.27 51.75,8.28
N$195
  cutout Route2: 53.02,5.49 53.06,5.51 53.1,5.49 53.14,5.47 53.16,5.46 53.15,5.44 53.11,5.42 53.07,5.44 53.03,5.46 52.99,5.46
N$196
  cutout Route2: 53.02,6.5 52.98,6.47 52.92,6.46 52.86,6.47 52.8,6.49 52.75,6.52 52.73,6.56 52.73,6.58 52.75,6.58 52.86,6.55 52.94,6.53 52.97,6.56 52.98,6.59 53.01,6.57
N$197
  cutout Route2: 53.39,6.67 53.46,6.65 53.47,6.63 53.43,6.63
N$198
  cutout Route15: 53.58,6.82 53.55,6.82 53.52,6.83 53.49,6.85 53.47,6.89 53.46,6.91 53.48,6.91 53.52,6.89 53.53,6.89 53.6,6.87 53.62,6.84
N$199
  pour Route15: 53.72,7.26 53.77,7.28 53.87,7.24 53.95,7.22 54.05,7.2 53.95,7.18 53.92,7.18 53.79,7.21 53.74,7.23 53.63,7.2 53.69,7.24 53.65,7.25 53.62,7.26 53.6,7.26 53.6,7.28 53.61,7.33 53.65,7.32 53.71,7.3 53.73,7.3 53.73,7.28 53.72,7.26
N$200
  pour Route15: 53.88,6.76 53.88,6.73 53.86,6.74 53.78,6.76 53.72,6.77 53.68,6.81 53.66,6.83 53.7,6.83 53.74,6.84 53.78,6.84 53.8,6.83 53.84,6.83 53.87,6.8
N$201
  pour Route15: 53.63,6.56 53.62,6.57 53.64,6.58 53.71,6.6 53.87,6.56 54,6.53 54.01,6.5 53.85,6.48 53.77,6.49 53.71,6.5 53.67,6.52
N$202
  cutout Route2: 53.92,6.43 54.01,6.43 54.03,6.41 54,6.4
N$203
  cutout Route2: 54.11,6.29 54.11,6.27 54.06,6.28 53.99,6.3 53.94,6.33 53.92,6.35 53.92,6.36 53.93,6.37 53.95,6.38 53.95,6.36 53.96,6.36 53.95,6.36 53.96,6.36 53.98,6.35 54.11,6.31 54.11,6.31 54.11,6.31 54.15,6.3
N$204
  cutout Route2: 54.13,6.53 54.14,6.53 54.14,6.52 54.14,6.49 54.13,6.47 54.11,6.46 54.08,6.45 54.05,6.45 54.04,6.46 54.04,6.47 54.03,6.52 54.03,6.53 54.04,6.54
N$205
  cutout Route2: 54.18,7.5 54.15,7.52 54.18,7.54 54.25,7.54 54.35,7.52 54.5,7.5 54.5,7.46 54.41,7.45 54.29,7.46
N$206
  cutout Route15: 54.54,7.01 54.57,6.99 54.62,6.98 54.57,6.96 54.52,6.95 54.44,6.97 54.42,6.99 54.43,7 54.48,7.03
N$207